# Altium project Medical_Box_Ver_2.PrjPcb
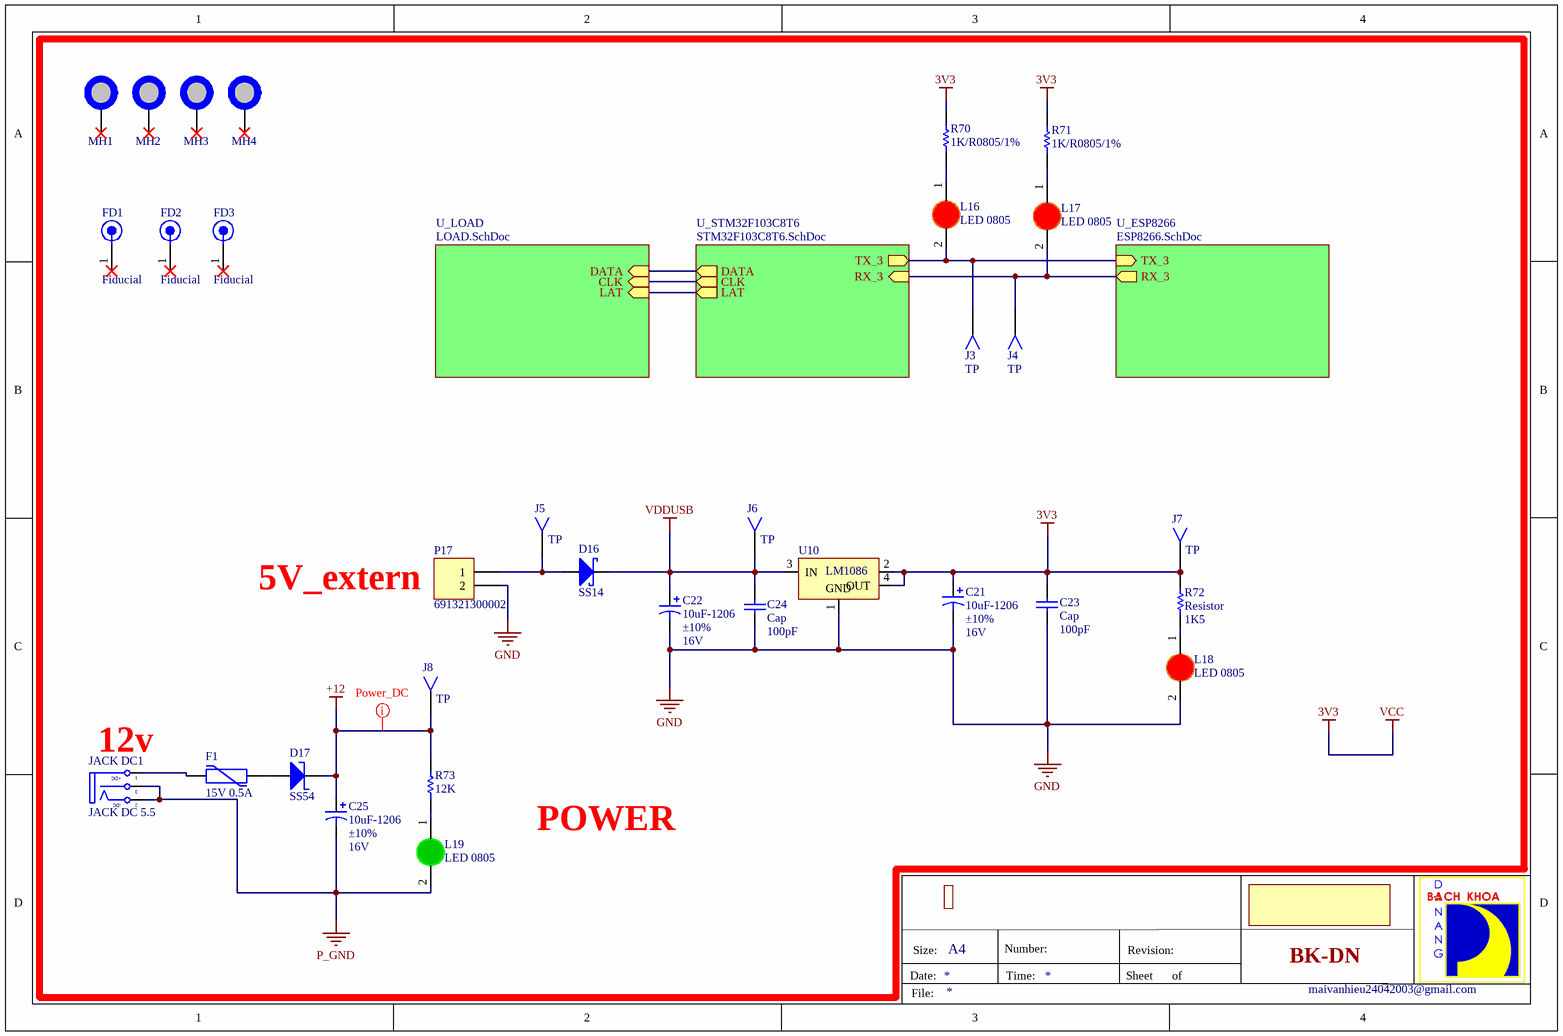
[diagram p0: Block_Diagram.SchDoc]
4 sheets, 206 parts. Net scope: hierarchical (ports join the sheet entries above them; power ports are global).
Board file: PCB1.PcbDoc
Sheets:
  Block_Diagram.SchDoc
    U_ESP8266 = ESP8266.SchDoc
    U_LOAD = LOAD.SchDoc
    U_STM32F103C8T6 = STM32F103C8T6.SchDoc

## Sheet Block_Diagram.SchDoc
size A4; Author: Van Hieu; Organization: BACH-KHOA-DK; Gmail: maivanhieu24042003@gmail.com

### Parts
C21  10uF-1206  Tolerance: ±10%  Voltage - Rated: 16V  [CAP1206_TANTALUM_YELLOW]
C22  10uF-1206  Tolerance: ±10%  Voltage - Rated: 16V  [CAP1206_TANTALUM_YELLOW]
C23  Cap  value 100pF  [CAPC2012L]
C24  Cap  value 100pF  [CAPC2012L]
C25  10uF-1206  Tolerance: ±10%  Voltage - Rated: 16V  [CAP1206_TANTALUM_YELLOW]
D16  SS14  [DIODE SMD]
D17  SS54  [DO-214AB/SMC]
F1  15V 0.5A  [FUSE_PTC_SMD1812_02]
FD1  Fiducial  [FIDUCIAL_TOP]
FD2  Fiducial  [FIDUCIAL_TOP]
FD3  Fiducial  [FIDUCIAL_TOP]
J3  TP  [TEST_POINT_1.0X1.0MM]
J4  TP  [TEST_POINT_1.0X1.0MM]
J5  TP  [TEST_POINT_1.0X1.0MM]
J6  TP  [TEST_POINT_1.0X1.0MM]
J7  TP  [TEST_POINT_1.0X1.0MM]
J8  TP  [TEST_POINT_1.0X1.0MM]
JACK_DC1  JACK DC 5.5  [JACK DC 5.5]
L16  LED 0805  [LED-RED-0805]
L17  LED 0805  [LED-RED-0805]
L18  LED 0805  [LED-RED-0805]
L19  LED 0805  [LED-GREEN-0805]
MH1  MH_3MMC_2.1MMD  [MH_3MMD_2.1MMD]  (value not drawn)  (no BOM)
MH2  MH_3MMC_2.1MMD  [MH_3MMD_2.1MMD]  (value not drawn)  (no BOM)
MH3  MH_3MMC_2.1MMD  [MH_3MMD_2.1MMD]  (value not drawn)  (no BOM)
MH4  MH_3MMC_2.1MMD  [MH_3MMD_2.1MMD]  (value not drawn)  (no BOM)
P17  691321300002  [TERMINAL_KF2EDGV_F_1X2_3.81]
R70  1K/R0805/1%  [Res 0805 SMD]
R71  1K/R0805/1%  [Res 0805 SMD]
R72  Resistor  value 1K5  [RESC2012L]
R73  value 12K  [RESC2012L]  (hidden comment: Resistor)
U10  LM1086  [LM1086]

### Sub-sheets
U_ESP8266 = ESP8266.SchDoc: RX_3 (out), TX_3 (in)
U_LOAD = LOAD.SchDoc: DATA (in), CLK (in), LAT (in)
U_STM32F103C8T6 = STM32F103C8T6.SchDoc: RX_3 (in), TX_3 (out), DATA (out), CLK (out), LAT (out)

### Nets
3V3: C21.1 C23.1 J7.1 R70.2 R71.2 R72.1 U10.2(OUT) U10.4(OUT)  [also labelled VCC]
+12: C25.1 D17.2(K) J8.1 R73.2
GND: C21.2 C22.2 C23.2 C24.2 L18.2(K) P17.2 U10.1(GND)
P_GND: C25.2 JACK_DC1.2(TN) JACK_DC1.3(S) L19.2(K)
VDDUSB: C22.1 C24.1 D16.2(K) J6.1 U10.3(IN)
CLK: sheet U_LOAD/CLK, sheet U_STM32F103C8T6/CLK
DATA: sheet U_LOAD/DATA, sheet U_STM32F103C8T6/DATA
LAT: sheet U_LOAD/LAT, sheet U_STM32F103C8T6/LAT
RX_3: J4.1 L17.2(K) ; sheet U_ESP8266/RX_3, sheet U_STM32F103C8T6/RX_3
TX_3: J3.1 L16.2(K) ; sheet U_ESP8266/TX_3, sheet U_STM32F103C8T6/TX_3
NetD16_1: D16.1(A) J5.1 P17.1
NetD17_1: D17.1(A) F1.2
NetF1_1: F1.1 JACK_DC1.1(T)
NetL16_1: L16.1(A) R70.1
NetL17_1: L17.1(A) R71.1
NetL18_1: L18.1(A) R72.2
NetL19_1: L19.1(A) R73.1

Not connected (* = marked no-connect by the designer): FD1 1*; FD2 1*; FD3 1*; MH1 1*; MH2 1*; MH3 1*; MH4 1*

### Layout directives
power_DC: power_DC: +12

### Notes on the sheet
- (near P17) 5V_extern
- (near JACK_DC1) 12v
- POWER
- Van Hieu
- Date:
- Size:
- A4
- Number:
- Time:
- Sheet
- Revision:
- of
- BK-DN
- File:
- maivanhieu24042003@gmail.com
- (in symbol JACK DC 5.5) +DC; -DC

### Library data of the parts
C21 C22 C25 = T491A106K016AT: CAP TANT 10UF 16V 10% 1206; Manufacturer 1: KEMET; Manufacturer Size Code: A; Category 1: Capacitors; Capacitance: 10µF; Type: Molded; ESR (Equivalent Series Resistance): 7 Ohm; Lifetime @ Temp.: 2000 Hrs @ 85°C; Supplier 1: Digi-Key; Supplier Part Number 1: 399-8269-1-ND; Manufacturer Part Number 1: T491A106K016AT; RoHS 1: RoHS Compliant; Description 1: CAP TANT 10UF 16V 10% 1206; Stock 1: 54083; Pricing 1: 1=0.45, 10=0.312, 100=0.1873, 500=0.14048, 1000=0.11862 (USD); Packaging: Cut Tape (CT); Part Status: Active; Operating Temperature: -55°C ~ 125°C; Mounting Type: Surface Mount; Package / Case: 1206 (3216 Metric); Size / Dimension: 0.126" L x 0.063" W (3.20mm x 1.60mm); Height - Seated (Max): 0.071" (1.80mm); Lead Spacing: -; Features: General Purpose; Failure Rate: -; ComponentLink1URL: http://www.kemet.com/Lists/ProductCatalog/Attachments/254/KEM_T2005_T491.pdf; ComponentLink1Description: http://www.kemet.com/Lists/ProductCatalog/Attachments/254/KEM_T2005_T491.pdf; Value: 10uF
C23 C24 = Cap: Capacitor; Published: 8-Jun-2000; LatestRevisionDate: 17-Jul-2002; LatestRevisionNote: Re-released for DXP Platform.; PackageReference: RAD-0.3; Publisher: Altium Limited
D16 = Diode SS14 ( 1N5819): Dán; Ma_Hang: MH002211; Don_Vi: Con; So_Chan: 2; Kieu_Chan: DO214; Ten_Linh_Kien: Diode SS14 DO214 Schottky 1A 40V ( 1N5819 DO214); Chung_Loai: Dán
D17 = Diode Schottky: Buy Link: https://www.thegioiic.com/products/ss54-smc
F1 = FUSE_MF-MSMF050-2: BOURNS         MF-MSMF110/16-2            FUSE, RESETTABLE PTC, 16V, 1.1A, 1812, FULL REEL; Number of Terminals/Pins: 2; Max Current Rating: 100A; Power Dissipation: 800mW; Hold Current: 500mA; Trip Current: 1A; Resistance: 150mR; Time to Trip: 0.15s; Aging: 1000 hr @ +85 °C (Passive); Approvals: UL,CSA,TUV; Supplier 1: Digi-Key; Supplier Part Number 1: MF-MSMF050-2TR-ND; Manufacturer: Bourns; Manufacturer Part Number: MF-MSMF050-2; RoHS: Yes; Category: Fuses; Stock 1: 20000; Pricing 1: 2000=0.15300, 4000=0.14400, 6000=0.13500, 10000=0.12600 (USD); Mount: Surface Mount,PCB; Case/Package: 1812; Number of Pins: 2; Case Code (Metric): 4532; Case Code (Imperial): 1812; Contact Plating: Gold; Terminal Material: Gold; Min Operating Temperature: -40°C; Max Operating Temperature: 85°C; Package Quantity: 2000; Packaging: Tape and Reel; Voltage Rating: 15V; Operating Supply Voltage: 15V; Current Rating: 100A; Termination: SMD/SMT; Voltage Rating (DC): 15V; Series: MF-MSMF; Length: 4.73mm; Width: 3.41mm; Height: 0.85mm; Radiation Hardening: No; REACH SVHC: No SVHC; Lead Free: Lead Free; RoHS Compliant: Yes; ComponentLink1URL: https://datasheet.ciiva.com/34302/1164200-34302041.pdf?src-supplier=Jameco; ComponentLink1Description: https://datasheet.ciiva.com/34302/1164200-34302041.pdf?src-supplier=Jameco; ComponentLink2URL: https://datasheet.ciiva.com/326/mfmsmf-326354.pdf?src-supplier=Digi-Key; ComponentLink2Description: https://datasheet.ciiva.com/326/mfmsmf-326354.pdf?src-supplier=Digi-Key; ComponentLink3URL: https://datasheet.ciiva.com/1228/1786007-1228155.pdf?src-supplier=Newark; ComponentLink3Description: https://datasheet.ciiva.com/1228/1786007-1228155.pdf?src-supplier=Newark; ComponentLink4URL: https://datasheet.ciiva.com/16205/mfmsmf-16205994.pdf?src-supplier=Onlinecomponents.com; ComponentLink4Description: https://datasheet.ciiva.com/16205/mfmsmf-16205994.pdf?src-supplier=Onlinecomponents.com; ComponentLink5URL: https://datasheet.ciiva.com/14537/70153434-14537737.pdf?src-supplier=Allied+Electronics; ComponentLink5Description: https://datasheet.ciiva.com/14537/70153434-14537737.pdf?src-supplier=Allied+Electronics; ComponentLink6URL: https://datasheet.ciiva.com/46395/1695373-46395287.pdf?src-supplier=Element14; ComponentLink6Description: https://datasheet.ciiva.com/46395/1695373-46395287.pdf?src-supplier=Element14; ComponentLink7URL: https://datasheet.ciiva.com/22749/1695373-22749079.pdf?src-supplier=Element14; ComponentLink7Description: https://datasheet.ciiva.com/22749/1695373-22749079.pdf?src-supplier=Element14; ComponentLink8URL: https://datasheet.ciiva.com/32426/mf-msmf-series-eng-tds-32426126.pdf?src-supplier=Distrelec; ComponentLink8Description: https://datasheet.ciiva.com/32426/mf-msmf-series-eng-tds-32426126.pdf?src-supplier=Distrelec; ComponentLink9URL: https://datasheet.ciiva.com/4501/mfmsmf-72300-4501655.pdf?src-supplier=Mouser; ComponentLink9Description: https://datasheet.ciiva.com/4501/mfmsmf-72300-4501655.pdf?src-supplier=Mouser; ComponentLink10URL: https://datasheet.ciiva.com/3019/mfmsmf-3019622.pdf?src-supplier=Avnet; ComponentLink10Description: https://datasheet.ciiva.com/3019/mfmsmf-3019622.pdf?src-supplier=Avnet; ComponentLink11URL: https://datasheet.ciiva.com/3019/mfmsmf-3019621.pdf?src-supplier=Avnet; ComponentLink11Description: https://datasheet.ciiva.com/3019/mfmsmf-3019621.pdf?src-supplier=Avnet; ComponentLink12URL: https://datasheet.ciiva.com/326/mfmsmf-326356.pdf?src-supplier=Digi-Key; ComponentLink12Description: https://datasheet.ciiva.com/326/mfmsmf-326356.pdf?src-supplier=Digi-Key; ComponentLink13URL: https://datasheet.ciiva.com/1274/1786007-1274499.pdf?src-supplier=Element14; ComponentLink13Description: https://datasheet.ciiva.com/1274/1786007-1274499.pdf?src-supplier=Element14; ComponentLink14URL: https://datasheet.ciiva.com/326/mfmsmf-326355.pdf?src-supplier=Digi-Key; ComponentLink14Description: https://datasheet.ciiva.com/326/mfmsmf-326355.pdf?src-supplier=Digi-Key; ComponentLink15URL: https://datasheet.ciiva.com/1274/1786007-1274498.pdf?src-supplier=Element14; ComponentLink15Description: https://datasheet.ciiva.com/1274/1786007-1274498.pdf?src-supplier=Element14; ComponentLink16URL: https://datasheet.ciiva.com/15226/getdatasheetpartid-117168-15226886.pdf?src-supplier=Verical; ComponentLink16Description: https://datasheet.ciiva.com/15226/getdatasheetpartid-117168-15226886.pdf?src-supplier=Verical; ComponentLink17URL: https://datasheet.ciiva.com/25894/mfmsmf-25894175.pdf?src-supplier=Avnet+Europe; ComponentLink17Description: https://datasheet.ciiva.com/25894/mfmsmf-25894175.pdf?src-supplier=Avnet+Europe; Supplier 2: Digi-Key; Supplier Part Number 2: MF-MSMF110/16-2TR-ND; Stock 2: 8000; Pricing 2: 2000=0.16800, 4000=0.16500, 6000=0.16200, 10000=0.15960 (USD); Max Power Dissipation: 800mW; ComponentLink18URL: https://datasheet.ciiva.com/16206/mfmsmf-16206000.pdf?src-supplier=Onlinecomponents.com; ComponentLink18Description: https://datasheet.ciiva.com/16206/mfmsmf-16206000.pdf?src-supplier=Onlinecomponents.com; ComponentLink19URL: https://datasheet.ciiva.com/34302/1164242-34302042.pdf?src-supplier=Jameco; ComponentLink19Description: https://datasheet.ciiva.com/34302/1164242-34302042.pdf?src-supplier=Jameco; ComponentLink20URL: https://datasheet.ciiva.com/326/mfmsmf-326551.pdf?src-supplier=Digi-Key; ComponentLink20Description: https://datasheet.ciiva.com/326/mfmsmf-326551.pdf?src-supplier=Digi-Key; ComponentLink21URL: https://datasheet.ciiva.com/1274/1786007-1274504.pdf?src-supplier=Element14; ComponentLink21Description: https://datasheet.ciiva.com/1274/1786007-1274504.pdf?src-supplier=Element14; ComponentLink22URL: https://datasheet.ciiva.com/326/mfmsmf-326553.pdf?src-supplier=Digi-Key; ComponentLink22Description: https://datasheet.ciiva.com/326/mfmsmf-326553.pdf?src-supplier=Digi-Key; ComponentLink23URL: https://datasheet.ciiva.com/1274/1786007-1274505.pdf?src-supplier=Element14; ComponentLink23Description: https://datasheet.ciiva.com/1274/1786007-1274505.pdf?src-supplier=Element14; ComponentLink24URL: https://datasheet.ciiva.com/17401/mfmsmf-17401721.pdf?src-supplier=Avnet+Europe; ComponentLink24Description: https://datasheet.ciiva.com/17401/mfmsmf-17401721.pdf?src-supplier=Avnet+Europe; ComponentLink25URL: https://datasheet.ciiva.com/30134/575mfmsmf-30134057.pdf?src-supplier=Onlinecomponents.com; ComponentLink25Description: https://datasheet.ciiva.com/30134/575mfmsmf-30134057.pdf?src-supplier=Onlinecomponents.com; ComponentLink26URL: https://datasheet.ciiva.com/3020/mfmsmf-3020011.pdf?src-supplier=Avnet; ComponentLink26Description: https://datasheet.ciiva.com/3020/mfmsmf-3020011.pdf?src-supplier=Avnet; ComponentLink27URL: https://datasheet.ciiva.com/3019/mfmsmf-3019628.pdf?src-supplier=Avnet; ComponentLink27Description: https://datasheet.ciiva.com/3019/mfmsmf-3019628.pdf?src-supplier=Avnet; ComponentLink28URL: https://datasheet.ciiva.com/1228/1786007-1228158.pdf?src-supplier=Newark; ComponentLink28Description: https://datasheet.ciiva.com/1228/1786007-1228158.pdf?src-supplier=Newark; ComponentLink29URL: https://datasheet.ciiva.com/28411/1695373-28411566.pdf?src-supplier=Element14; ComponentLink29Description: https://datasheet.ciiva.com/28411/1695373-28411566.pdf?src-supplier=Element14; ComponentLink30URL: https://datasheet.ciiva.com/326/mfmsmf-326552.pdf?src-supplier=Digi-Key; ComponentLink30Description: https://datasheet.ciiva.com/326/mfmsmf-326552.pdf?src-supplier=Digi-Key; ComponentLink31URL: https://datasheet.ciiva.com/14538/70153434-14538680.pdf?src-supplier=Allied+Electronics; ComponentLink31Description: https://datasheet.ciiva.com/14538/70153434-14538680.pdf?src-supplier=Allied+Electronics; ComponentLink32URL: https://datasheet.ciiva.com/15187/getdatasheetpartid-115224-15187116.pdf?src-supplier=Verical; ComponentLink32Description: https://datasheet.ciiva.com/15187/getdatasheetpartid-115224-15187116.pdf?src-supplier=Verical
J3-J8 = TEST POINT 1.0X1.0: Manufacturer 1: Bourns Inc.; Manufacturer Part Number 1: PTV09A-4020U-B103; Description 1: POT 10K OHM 1/20W CARBON LINEAR; Category 1: Potentiometers, Variable Resistors; Resistance (Ohms): 10k; Tolerance: ±20%; Built in Switch: None; Power (Watts): 0.05W, 1/20W; Number of Turns: 1; Rotation: 280°; Adjustment Type: Top Adjustment; Resistive Material: Carbon; Actuator Type: Knurled; Actuator Length: 0.787" (20.00mm); Actuator Diameter: 0.236" (6.00mm); Supplier 1: Digi-Key; Supplier Part Number 1: PTV09A-4020U-B103-ND; RoHS 1: RoHS Compliant; Stock 1: 414; Pricing 1: 1=0.83, 10=0.744, 25=0.672, 50=0.648, 100=0.612, 250=0.588, 500=0.552, 1000=0.456, 5000=0.372 (USD); Packaging: Tray; Part Status: Active; Taper: Linear; Temperature Coefficient: -; Termination Style: PC Pins, Board Locks; Bushing Thread: -; Mounting Type: Through Hole, Snap In; ComponentLink1URL: http://www.bourns.com/docs/Product-Datasheets/PTV09.pdf; ComponentLink1Description: http://www.bourns.com/docs/Product-Datasheets/PTV09.pdf
JACK_DC1 = JACK DC 5.5: Value: Jac DC
L16-L18 = LED RED 0805: SMD; Don_Vi: Con; Chung_Loai: Dán; Ma_Hang: MH000897; Ten_Linh_Kien: LED 0805 Màu Đỏ (Red); Ghi_Chu: *; Kieu_Chan: *
L19 = LED GREEN 0805: SMD; Don_Vi: Con; Chung_Loai: Dán; Ma_Hang: MH000897; Ten_Linh_Kien: LED 0805 Màu Đỏ (Red); Ghi_Chu: *; Kieu_Chan: *
MH1-MH4 = MH_3MMC_2.1MMD: Mounting Hole 3mm Diameter, 2.1mm Drill
P17 = TERMINAL_KF2EDGV_F_1X2_3.81: TERM BLOCK HDR 2POS VERT 3.81MM; Manufacturer: Wurth Electronics Inc.; Number of Positions: 2; Number of Levels: 1; Pitch: 0.150" (3.81mm); Header Orientation: Vertical; Material Flammability Rating: UL94 V-0; Contact Tail Length: 0.138" (3.50mm); Supplier 1: Digi-Key; Manufacturer Part Number: 691321300002; RoHS: RoHS Compliant; Category: Connectors, Interconnects; Stock 1: 2512; Pricing 1: 1=0.33, 10=0.296, 50=0.255, 100=0.2375 (USD); Packaging: Bulk; Part Status: Active; Type: Header, Male Pins, Shrouded (4 Side); Positions Per Level: 2; Plug Wire Entry: -; Termination Style: Solder; Mounting Type: Through Hole; Current - IEC: -; Wire Gauge or Range - AWG: -; Wire Gauge or Range - mm²: -; Color: Green; Operating Temperature: -40°C ~ 105°C; Contact Mating Finish: Tin; Features: -; Ingress Protection: -; Screw Size: -; Torque - Screw: -; Wire Strip Length: -; Contact Material: Brass; Housing Material: Polyamide (PA66), Nylon 6/6; Insulation Height: 0.362" (9.20mm); ComponentLink1URL: http://katalog.we-online.de/em/datasheet/6913213000xx.pdf; ComponentLink1Description: http://katalog.we-online.de/em/datasheet/6913213000xx.pdf; Supplier Part Number 1: 732-2082-ND
R70 R71 = 34.8K/R0805/1%_3: 1 kOhms ±1% 0.125W, 1/8W Chip Resistor 0805 (2012 Metric) Automotive AEC-Q200 Thick Film; Power Rating: 100mW; Resistance: 34.8kR; Voltage Rating: 50V; Case/Package: 0603; Case Code (Imperial): 0603; Case Code (Metric): 1608; Min Operating Temperature: -55°C; Max Operating Temperature: 155°C; Termination: SMD/SMT; Military Standard: Not; Voltage Rating (DC): 50V; Length: 1.6mm; Height: 0.45mm; Width: 0.8mm; Depth: 0.8mm; Lead Free: Lead Free; Digikey: 541-1.00KCCT-ND
R72 R73 = Resistor: Semiconductor Resistor; Published: 8-Jun-2000; LatestRevisionDate: 17-Jul-2002; LatestRevisionNote: Re-released for DXP Platform.; PackageReference: AXIAL-0.5; Publisher: Altium Limited
U10 = LM1086: Linear Voltage Regulator 3V3 1.5A 24V Max TO-220; ComponentLink1Description: Datasheet; ComponentLink1URL: D:\Dropbox\Datasheets\Power Management ICs\Linear Regulators\LM78XX.pdf; Unit Price: 0.3000

## Sheet ESP8266.SchDoc
size A3; Author: Bao Thuan; Organization: BACH-KHOA-DK
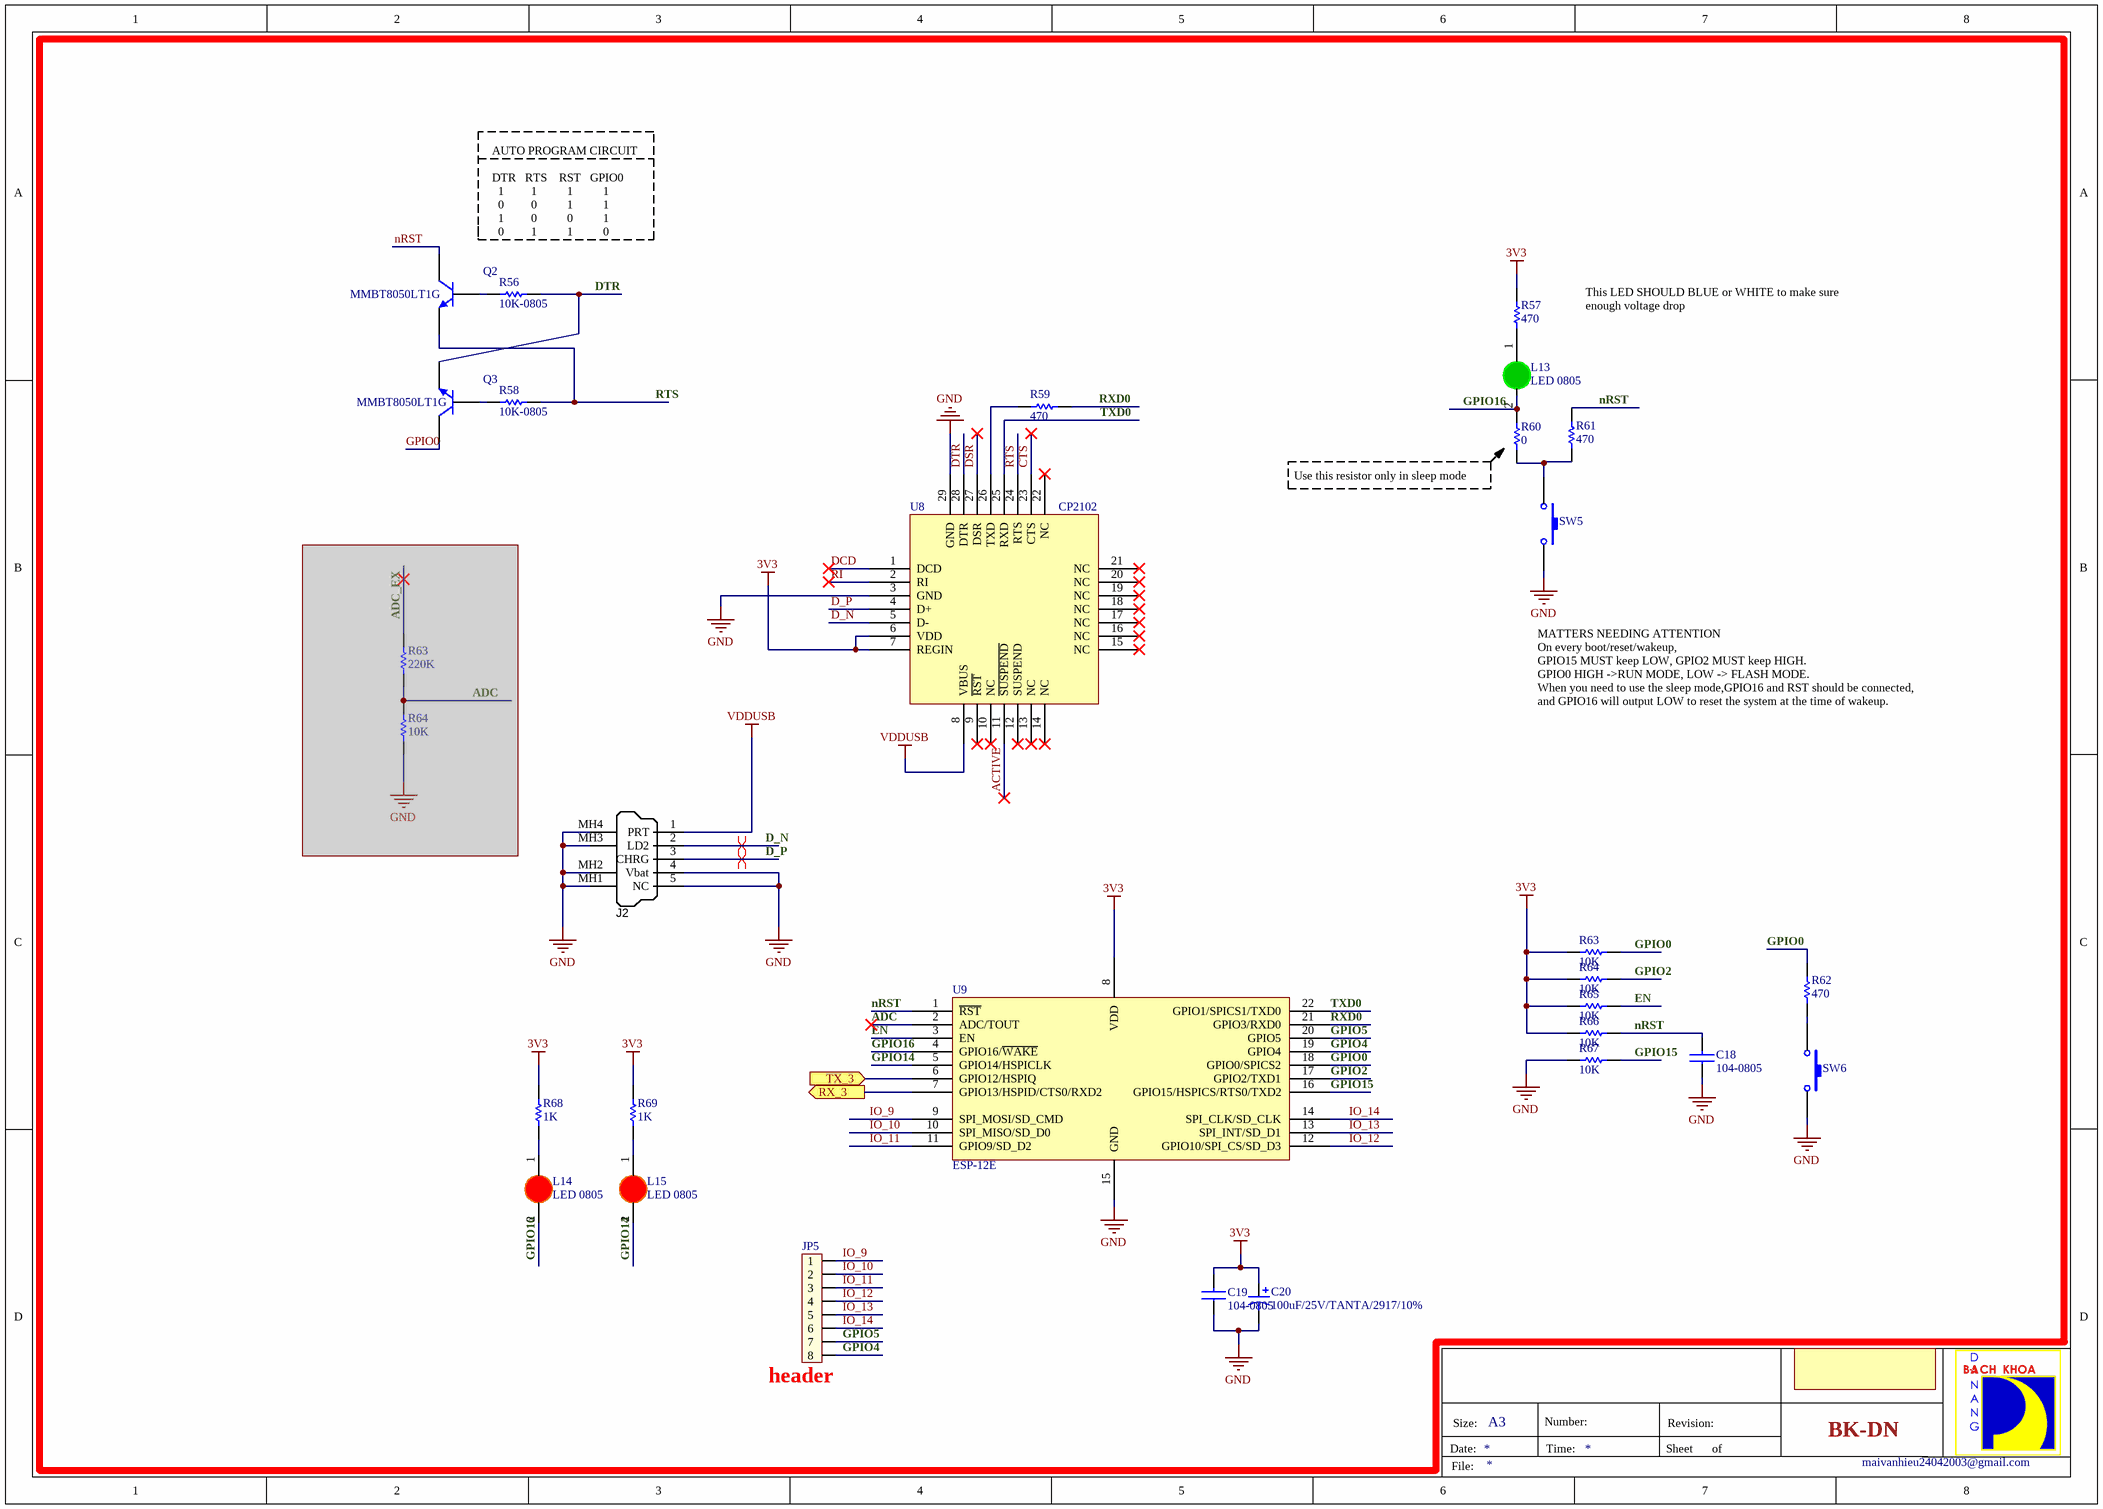
[diagram p1: ESP8266.SchDoc]

### Parts
(Parts that share a designator on the sheet are numbered #1, #2 ... from top to bottom, then left to right.)
C18  104-0805  [CAP0805]
C19  104-0805  [CAP0805]
C20  100uF/25V/TANTA/2917/10%  [CAP TANT CASE X SMD]
J2  USB_Mini-B  [USB_Mini-B_Molex_SMT]  (value not drawn)
JP5  header  [JP8]
L13  LED 0805  [LED-GREEN-0805]
L14  LED 0805  [LED-RED-0805]
L15  LED 0805  [LED-RED-0805]
Q2  MMBT8050LT1G  [SOT23]
Q3  MMBT8050LT1G  [SOT23]
R56  value 10K-0805  [RESC2012L]  (hidden comment: Resistor)
R57  value 470  [RESC2012L]  (hidden comment: Resistor)
R58  value 10K-0805  [RESC2012L]  (hidden comment: Resistor)
R59  value 470  [RESC2012L]  (hidden comment: Resistor)
R60  value 0  [RESC2012L]  (hidden comment: Resistor)
R61  value 470  [RESC2012L]  (hidden comment: Resistor)
R62  value 470  [RESC2012L]  (hidden comment: Resistor)
R63#1  value 220K  [RESC2012L]  (hidden comment: Resistor)  (masked out: inside a compile mask, not in the netlist)
R63#2  value 10K  [RESC2012L]  (hidden comment: Resistor)
R64#1  value 10K  [RESC2012L]  (hidden comment: Resistor)  (masked out: inside a compile mask, not in the netlist)
R64#2  value 10K  [RESC2012L]  (hidden comment: Resistor)
R65  value 10K  [RESC2012L]  (hidden comment: Resistor)
R66  value 10K  [RESC2012L]  (hidden comment: Resistor)
R67  value 10K  [RESC2012L]  (hidden comment: Resistor)
R68  value 1K  [RESC2012L]  (hidden comment: Resistor)
R69  value 1K  [RESC2012L]  (hidden comment: Resistor)
SW5  RS-282G05A3-SM RT  [SW_RS-282G05A3-SM RT]  (value not drawn)
SW6  RS-282G05A3-SM RT  [SW_RS-282G05A3-SM RT]  (value not drawn)
U8  CP2102  [CP2102]
U9  ESP-12E  [ESP-12E]

### Ports
RX_3 (out), TX_3 (in)

### Nets
3V3: C19.2 C20.1 R57.2 R63#2.1 R64#2.1 R65.1 R66.1 R68.2 R69.2 U8.6(VDD) U8.7(REGIN) U9.8(VDD)
GND: C18.1 C19.1 C20.2 J2.4(Vbat) J2.5(NC) J2.MH1(Shell) J2.MH2(Shell) J2.MH3(Shell) J2.MH4(Shell) R67.1 SW5.1 SW6.1 U8.3(GND) U8.29(GND) U9.15(GND)
VDDUSB: J2.1(PRT) U8.8(VBUS)
ACTIVE: U8.11(~{SUSPEND})
ADC: U9.2(ADC/TOUT)
CTS: U8.23(CTS)
D_N: J2.2(LD2) U8.5(D-)
D_P: J2.3(CHRG) U8.4(D+)
DCD: U8.1(DCD)
DSR: U8.27(DSR)
DTR: Q3.2(E) R56.2 U8.28(DTR)
EN: R65.2 U9.3(EN)
GPIO0: Q3.3(C) R62.2 R63#2.2 U9.18(GPIO0/SPICS2)
GPIO2: R64#2.2 U9.17(GPIO2/TXD1)
GPIO4: JP5.8 U9.19(GPIO4)
GPIO5: JP5.7 U9.20(GPIO5)
GPIO14: L15.2(K) U9.5(GPIO14/HSPICLK)
GPIO15: R67.2 U9.16(GPIO15/HSPICS/RTS0/TXD2)
GPIO16: L13.2(K) L14.2(K) R60.2 U9.4(GPIO16/~{WAKE})
IO_9: JP5.1 U9.9(SPI_MOSI/SD_CMD)
IO_10: JP5.2 U9.10(SPI_MISO/SD_D0)
IO_11: JP5.3 U9.11(GPIO9/SD_D2)
IO_12: JP5.4 U9.12(GPIO10/SPI_CS/SD_D3)
IO_13: JP5.5 U9.13(SPI_INT/SD_D1)
IO_14: JP5.6 U9.14(SPI_CLK/SD_CLK)
nRST: C18.2 Q2.3(C) R61.2 R66.2 U9.1(~{RST})
RI: U8.2(RI)
RTS: Q2.2(E) R58.2 U8.24(RTS)
RX_3: U9.7(GPIO13/HSPID/CTS0/RXD2) ; port RX_3
RXD0: R59.2 U9.21(GPIO3/RXD0)
TX_3: U9.6(GPIO12/HSPIQ) ; port TX_3
TXD0: U8.25(RXD) U9.22(GPIO1/SPICS1/TXD0)
NetL13_1: L13.1(A) R57.1
NetL14_1: L14.1(A) R68.1
NetL15_1: L15.1(A) R69.1
NetQ2_1: Q2.1(B) R56.1
NetQ3_1: Q3.1(B) R58.1
NetR59_1: R59.1 U8.26(TXD)
NetR60_1: R60.1 R61.1 SW5.2
NetR62_1: R62.1 SW6.2

Not connected (* = marked no-connect by the designer): U8 9(~{RST})* 10(NC)* 12(SUSPEND)* 13(NC)* 14(NC)* 15(NC)* 16(NC)* 17(NC)* 18(NC)* 19(NC)* 20(NC)* 21(NC)* 22(NC)*

### Layout directives
differential pair: D_N, D_P

### Notes on the sheet
- AUTO PROGRAM CIRCUIT
  DTR   RTS    RST   GPIO0
  1         1          1          1
  0         0          1          1
  1         0          0          1
  0         1          1          0
- This LED SHOULD BLUE or WHITE to make sure enough voltage drop
- Use this resistor only in sleep mode
- MATTERS NEEDING ATTENTION
  On every boot/reset/wakeup,
  GPIO15 MUST keep LOW, GPIO2 MUST keep HIGH.
  GPIO0 HIGH ->RUN MODE, LOW -> FLASH MODE.
  When you need to use the sleep mode,GPIO16 and RST should be connected,
  and GPIO16 will output LOW to reset the system at the time of wakeup.
- Van Hieu
- Date:
- Size:
- A3
- Number:
- Time:
- Sheet
- Revision:
- of
- BK-DN
- File:
- maivanhieu24042003@gmail.com

### Library data of the parts
C18 C19 = CC0805JRNPO9BN200: Multilayer Ceramic Capacitors MLCC - SMD/SMT 20pF 50V NPO 5%; Manufacturer: Yageo; Type: General Purpose Surface-Mount Ceramic Multilayer Capacitor; Voltage Rating DC: 50 VDC; Class: Class 1; Dielectric: C0G (NP0); Supplier 1: Mouser; Manufacturer Part Number: CC0805JRNPO9BN200; RoHS: RoHS Compliant By Exemption; Category: Multilayer Ceramic Capacitors MLCC - SMD/SMT; Stock 1: 0; Pricing 1: 1=0.100, 10=0.040, 100=0.018, 1000=0.014, 4000=0.013 (USD); Capacitance: 20 pF; Length: 2 mm; Package / Case: 0805 (2012 metric); Packaging: Cut Tape; Product: General Type MLCCs; Series: CC; Termination Style: SMD/SMT; Tolerance: 5 %; Width: 1.25 mm; Brand: Yageo; Case Code - in: 0805; Case Code - mm: 2012; Maximum Operating Temperature: + 125 C; Minimum Operating Temperature: - 55 C; Product Type: Ceramic Capacitors; Standard Pack Qty: 4000; Subcategory: Capacitors; Termination: Standard; RoHS - Mouser: E; Minimum Order Quantity: 1; Reeling: True; ComponentLink1URL: http://www.mouser.com/datasheet/2/447/UPY-GP_NP0_16V-to-50V_16-1109089.pdf; ComponentLink1Description: http://www.mouser.com/datasheet/2/447/UPY-GP_NP0_16V-to-50V_16-1109089.pdf; Supplier Part Number 1: 603-CC805JRNPO9BN200
C20 = 100uF/6.3V/SIZE B/20%: CAP TANT 100UF 6.3V 20% 1411; Manufacturer: Kemet; Manufacturer Part Number: T491B107M006AT; Manufacturer Size Code: B; Capacitance: 100µF; ESR (Equivalent Series Resistance): 3 Ohm; Type: Molded; Lifetime @ Temp.: 2000 Hrs @ 85°C; RoHS: RoHS Compliant; Category: Capacitors; Packaging: Cut Tape (CT); Tolerance: ±20%; Voltage - Rated: 6.3V; Operating Temperature: -55°C ~ 125°C; Mounting Type: Surface Mount; Package / Case: 1411 (3528 Metric); Size / Dimension: 0.138" L x 0.110" W (3.50mm x 2.80mm); Height - Seated (Max): 0.083" (2.10mm); Lead Spacing: -; Features: General Purpose; ComponentLink1URL: http://www.kemet.com/Lists/ProductCatalog/Attachments/254/KEM_T2005_T491.pdf; ComponentLink1Description: http://www.kemet.com/Lists/ProductCatalog/Attachments/254/KEM_T2005_T491.pdf; Supplier 1: Digi-Key; Supplier Part Number 1: 399-3710-1-ND
J2 = USB_Mini-B: Connector SMD USB Type Mini-B; Manufacturer 1: Molex Connector Corporation; Manufacturer Part Number 1: 67503-1020; SCDType: undef; Package / Case: SMD; Supplier 1: Digi-Key; Supplier Part Number 1: WM5461CT-ND
JP5 = JP8: JP8 PIN; Value: JP7
L13 = LED GREEN 0805: as L19 on sheet Block_Diagram; Ghi_Chu: *; Kieu_Chan: *
L14 L15 = LED RED 0805: as L16 on sheet Block_Diagram; Ghi_Chu: *; Kieu_Chan: *
Q2 Q3 = MMBT8050LT1G_SMD: NPN General Purpose Amplifier; Published: 8-Jun-2000; LatestRevisionDate: 15-Jan-2003; LatestRevisionNote: PCB Footprint 'BCY-W3/D4.7' replaced; DatasheetVersion: 1997; PackageVersion: Sep-1998; PackageReference: TO-92A; Publisher: Altium Limited; Code_JEDEC: TO-92A; ComponentLink1Description: Manufacturer Link; ComponentLink1URL: http://www.fairchildsemi.com/; ComponentLink2Description: Datasheet; ComponentLink2URL: http://www.fairchildsemi.com/ds/2N%2F2N3904.pdf
R56-R62 R63#1 R63#2 R64#1 R64#2 R65-R69 = Resistor: Semiconductor Resistor; Published: 8-Jun-2000; LatestRevisionDate: 17-Jul-2002; LatestRevisionNote: Re-released for DXP Platform.; PackageReference: AXIAL-0.5; Publisher: Altium Limited
SW5 SW6 = SW_RS-282G05A3-SM RT: SWITCH TACTILE SPST-NO 0.05A 12V; Manufacturer: C&K; Switch Function: Off-Mom; Contact Rating @ Voltage: 0.05A @ 12VDC; Actuator Type: Rectangular Button; Actuator Height off PCB, Vertical: 2.50mm; Actuator Orientation: Top Actuated; Outline: 6.00mm x 3.60mm; Illumination: Non-Illuminated; Operating Force: 250gf; Actuator Material: Polyamide (PA), Nylon; Switch Travel: 0.25mm; Mechanical Life: 50,000 Cycles; Supplier 1: Digi-Key; Manufacturer Part Number: RS-282G05A3-SM RT; RoHS: RoHS Compliant; Category: Switches; Stock 1: 34459; Pricing 1: 1=0.81, 10=0.78, 25=0.7356, 50=0.6474, 100=0.5885, 250=0.55908, 500=0.54436, 1000=0.42666 (USD); Packaging: Digi-Reel®; Part Status: Active; Circuit: SPST-NO; Mounting Type: Surface Mount; Actuator Length, Right Angle: -; Termination Style: Gull Wing; Illumination Type, Color: -; Illumination Voltage (Nominal): -; Ingress Protection: -; Features: -; Operating Temperature: -; ComponentLink1URL: http://media.digikey.com/pdf/Data%20Sheets/C&K/RS-282G05A-SM_RT.pdf; ComponentLink1Description: http://media.digikey.com/pdf/Data%20Sheets/C&K/RS-282G05A-SM_RT.pdf; Supplier Part Number 1: CKN10384DKR-ND
U9 = ESP_12_E: ESP8266 ESP-12E Module (ESP8266, Castellated Holes); IC: ESP8266-EX; Vendor: Ai-thinker

## Sheet LOAD.SchDoc
size A2; Author: Van Hieu; Organization: BACH-KHOA-DK; Gmail: maivanhieu24042003@gmail.com
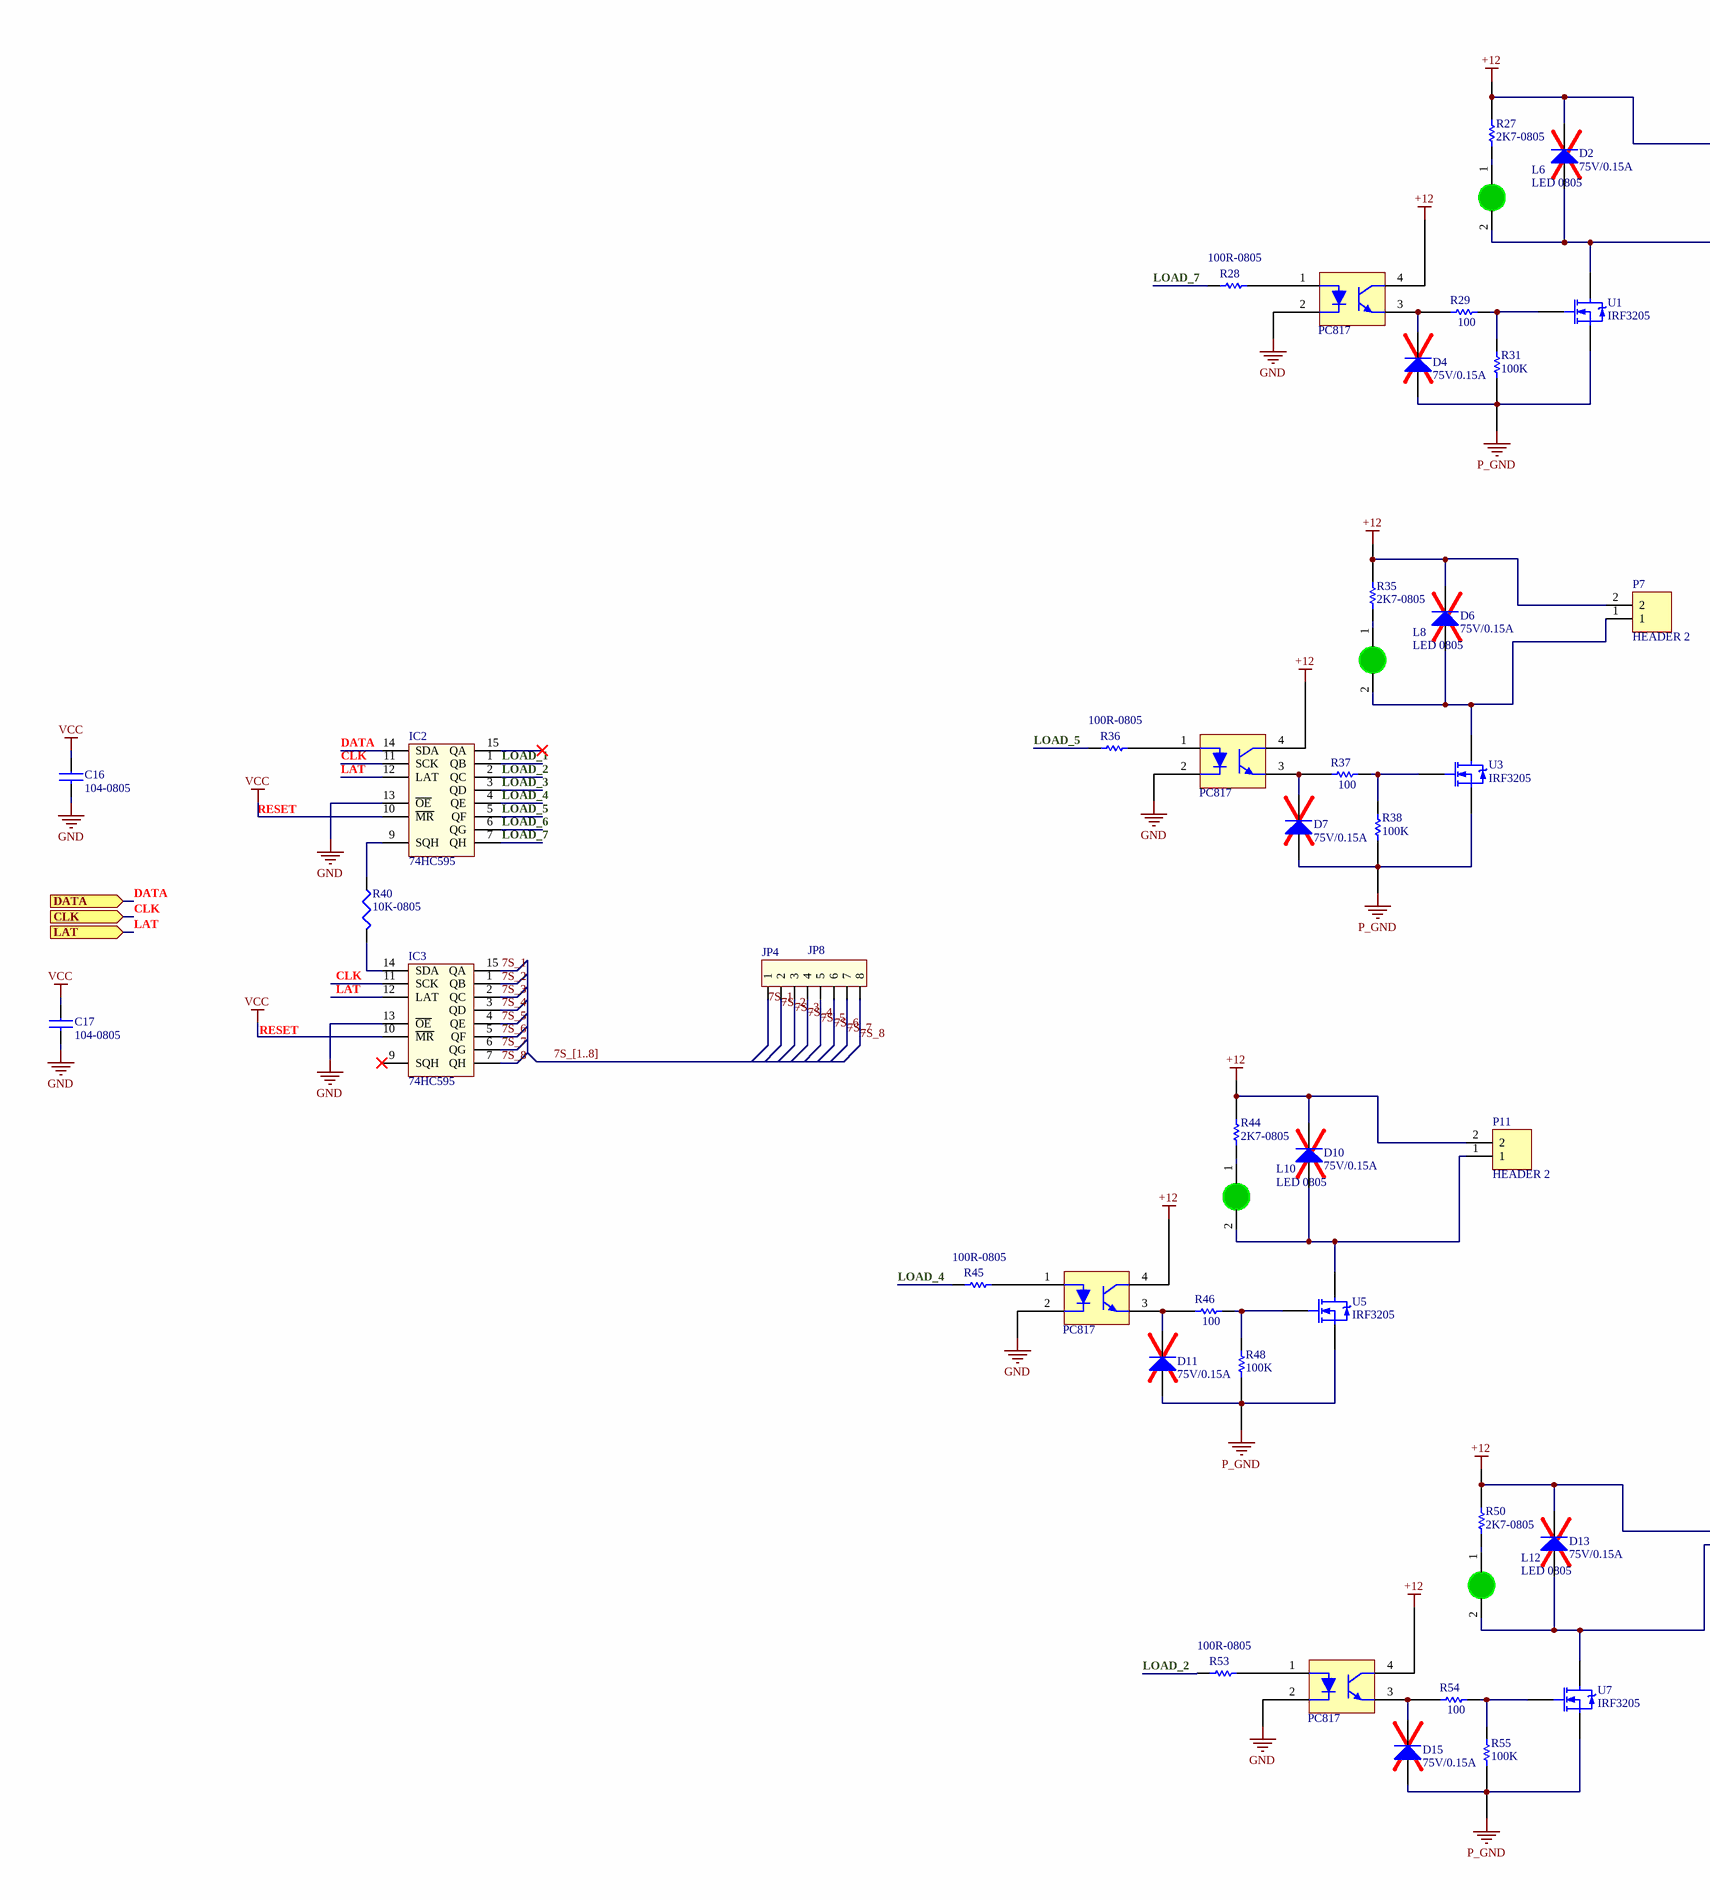
[diagram p2: LOAD.SchDoc, left]
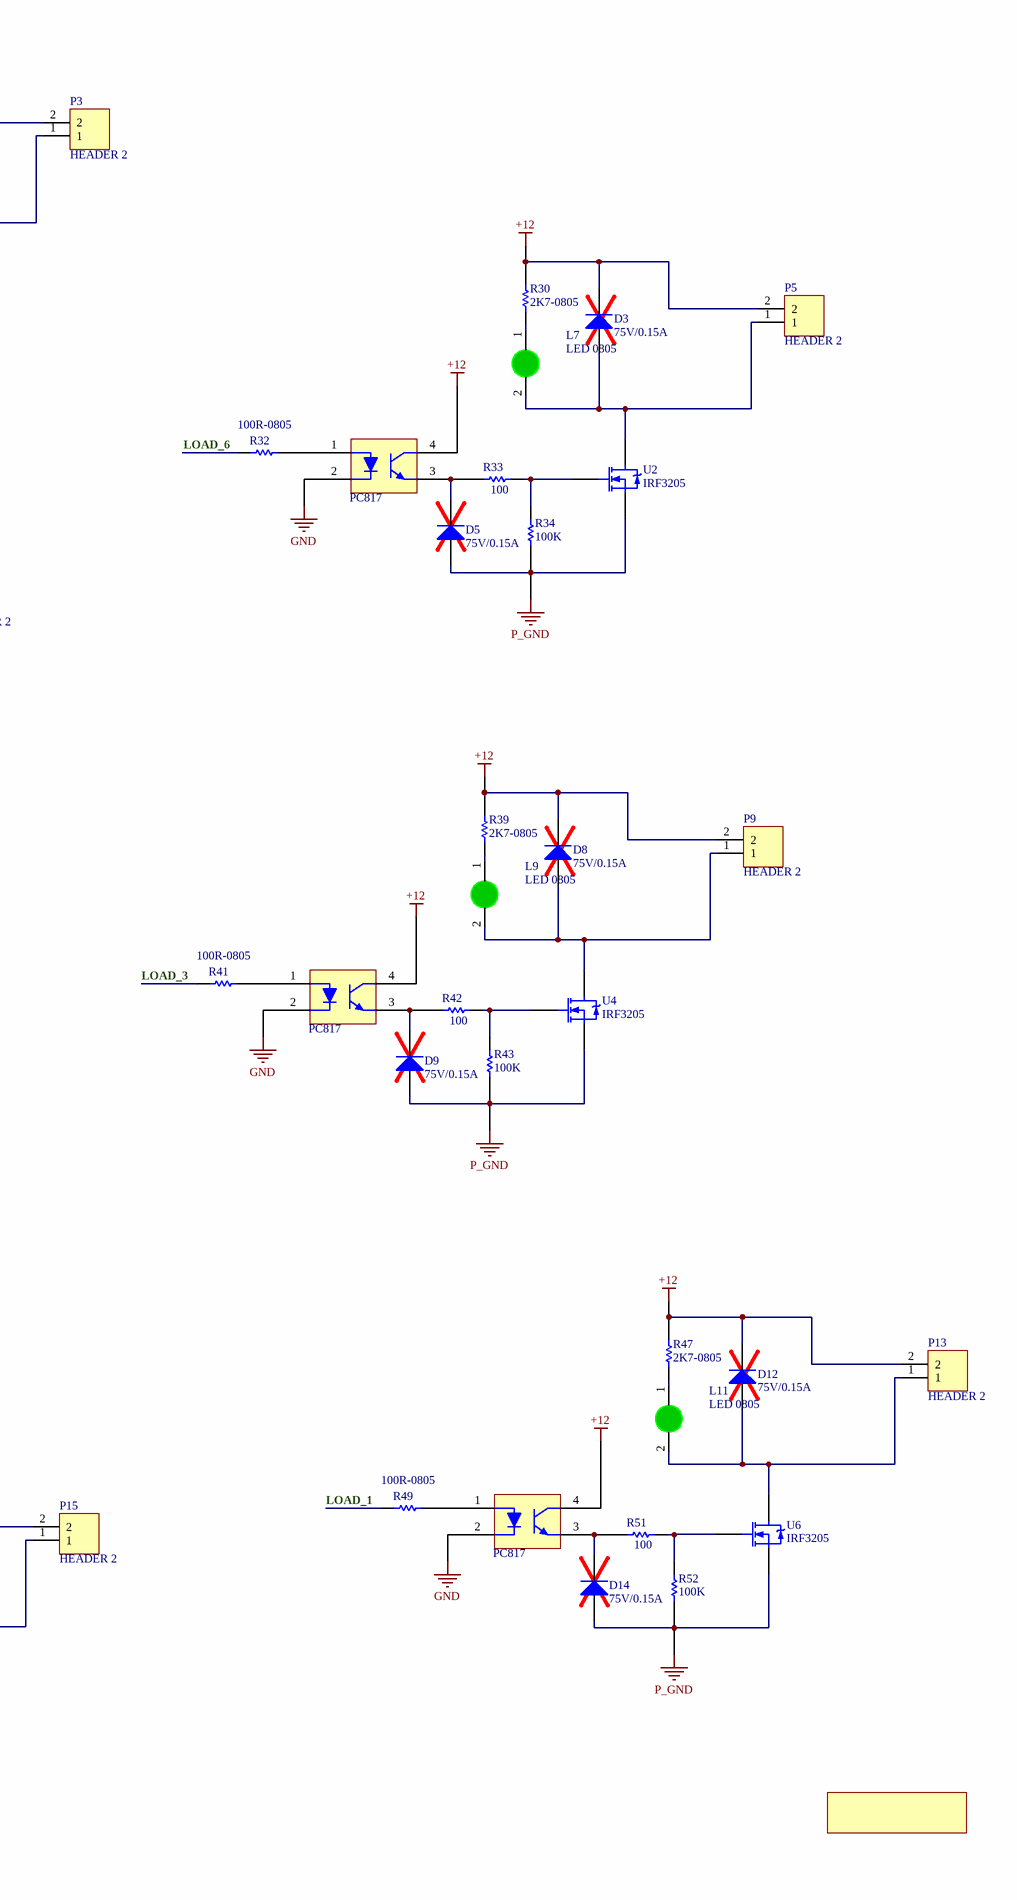
[diagram p3: LOAD.SchDoc, right]

### Parts
C16  104-0805  [CAP0805]
C17  104-0805  [CAP0805]
D2  75V/0.15A  [DIO-SOD232-1.15H]
D3  75V/0.15A  [DIO-SOD232-1.15H]
D4  75V/0.15A  [DIO-SOD232-1.15H]
D5  75V/0.15A  [DIO-SOD232-1.15H]
D6  75V/0.15A  [DIO-SOD232-1.15H]
D7  75V/0.15A  [DIO-SOD232-1.15H]
D8  75V/0.15A  [DIO-SOD232-1.15H]
D9  75V/0.15A  [DIO-SOD232-1.15H]
D10  75V/0.15A  [DIO-SOD232-1.15H]
D11  75V/0.15A  [DIO-SOD232-1.15H]
D12  75V/0.15A  [DIO-SOD232-1.15H]
D13  75V/0.15A  [DIO-SOD232-1.15H]
D14  75V/0.15A  [DIO-SOD232-1.15H]
D15  75V/0.15A  [DIO-SOD232-1.15H]
IC2  74HC595  [HC595_SOP127P600X175-16N]
IC3  74HC595  [HC595_SOP127P600X175-16N]
JP4  JP8  [CON8]
L6  LED 0805  [LED-GREEN-0805]
L7  LED 0805  [LED-GREEN-0805]
L8  LED 0805  [LED-GREEN-0805]
L9  LED 0805  [LED-GREEN-0805]
L10  LED 0805  [LED-GREEN-0805]
L11  LED 0805  [LED-GREEN-0805]
L12  LED 0805  [LED-GREEN-0805]
P3  HEADER 2  [HT508R-2P]
P4  PC817  [DIP-4]
P5  HEADER 2  [HT508R-2P]
P6  PC817  [DIP-4]
P7  HEADER 2  [HT508R-2P]
P8  PC817  [DIP-4]
P9  HEADER 2  [HT508R-2P]
P10  PC817  [DIP-4]
P11  HEADER 2  [HT508R-2P]
P12  PC817  [DIP-4]
P13  HEADER 2  [HT508R-2P]
P14  PC817  [DIP-4]
P15  HEADER 2  [HT508R-2P]
P16  PC817  [DIP-4]
R27  2K7-0805  [RESC2012L]
R28  100R-0805  [RESC2012L]
R29  100  [Res 0805 SMD]
R30  2K7-0805  [RESC2012L]
R31  100K  [Res 0805 SMD]
R32  100R-0805  [RESC2012L]
R33  100  [Res 0805 SMD]
R34  100K  [Res 0805 SMD]
R35  2K7-0805  [RESC2012L]
R36  100R-0805  [RESC2012L]
R37  100  [Res 0805 SMD]
R38  100K  [Res 0805 SMD]
R39  2K7-0805  [RESC2012L]
R40  10K-0805  [RES0805]
R41  100R-0805  [RESC2012L]
R42  100  [Res 0805 SMD]
R43  100K  [Res 0805 SMD]
R44  2K7-0805  [RESC2012L]
R45  100R-0805  [RESC2012L]
R46  100  [Res 0805 SMD]
R47  2K7-0805  [RESC2012L]
R48  100K  [Res 0805 SMD]
R49  100R-0805  [RESC2012L]
R50  2K7-0805  [RESC2012L]
R51  100  [Res 0805 SMD]
R52  100K  [Res 0805 SMD]
R53  100R-0805  [RESC2012L]
R54  100  [Res 0805 SMD]
R55  100K  [Res 0805 SMD]
U1  IRF3205  [TO-220]
U2  IRF3205  [TO-220]
U3  IRF3205  [TO-220]
U4  IRF3205  [TO-220]
U5  IRF3205  [TO-220]
U6  IRF3205  [TO-220]
U7  IRF3205  [TO-220]

### Ports
CLK (in), DATA (in), LAT (in)

### Nets
+12: D2.2(K) D3.2(K) D6.2(K) D8.2(K) D10.2(K) D12.2(K) D13.2(K) P3.2 P4.4 P5.2 P6.4 P7.2 P8.4 P9.2 P10.4 P11.2 P12.4 P13.2 P14.4 P15.2 P16.4 R27.2 R30.2 R35.2 R39.2 R44.2 R47.2 R50.2
GND: C16.2 C17.2 IC2.8(GND) IC2.13(~{OE}) IC3.8(GND) IC3.13(~{OE}) P4.2 P6.2 P8.2 P10.2 P12.2 P14.2 P16.2
P_GND: D4.1(A) D5.1(A) D7.1(A) D9.1(A) D11.1(A) D14.1(A) D15.1(A) R31.1 R34.1 R38.1 R43.1 R48.1 R52.1 R55.1 U1.3(S) U2.3(S) U3.3(S) U4.3(S) U5.3(S) U6.3(S) U7.3(S)
VCC: C16.1 C17.1 IC2.10(~{MR}) IC2.16(VCC) IC3.10(~{MR}) IC3.16(VCC)  [project net 3V3]
7S_1: IC3.15(QA) JP4.1
7S_2: IC3.1(QB) JP4.2
7S_3: IC3.2(QC) JP4.3
7S_4: IC3.3(QD) JP4.4
7S_5: IC3.4(QE) JP4.5
7S_6: IC3.5(QF) JP4.6
7S_7: IC3.6(QG) JP4.7
7S_8: IC3.7(QH) JP4.8
CLK: IC2.11(SCK) IC3.11(SCK) ; port CLK
DATA: IC2.14(SDA) ; port DATA
LAT: IC2.12(LAT) IC3.12(LAT) ; port LAT
LOAD_1: IC2.1(QB) R49.2
LOAD_2: IC2.2(QC) R53.2
LOAD_3: IC2.3(QD) R41.2
LOAD_4: IC2.4(QE) R45.2
LOAD_5: IC2.5(QF) R36.2
LOAD_6: IC2.6(QG) R32.2
LOAD_7: IC2.7(QH) R28.2
NetD2_1: D2.1(A) L6.2(K) P3.1 U1.2(D)
NetD3_1: D3.1(A) L7.2(K) P5.1 U2.2(D)
NetD4_2: D4.2(K) P4.3 R29.2
NetD5_2: D5.2(K) P6.3 R33.2
NetD6_1: D6.1(A) L8.2(K) P7.1 U3.2(D)
NetD7_2: D7.2(K) P8.3 R37.2
NetD8_1: D8.1(A) L9.2(K) P9.1 U4.2(D)
NetD9_2: D9.2(K) P10.3 R42.2
NetD10_1: D10.1(A) L10.2(K) P11.1 U5.2(D)
NetD11_2: D11.2(K) P12.3 R46.2
NetD12_1: D12.1(A) L11.2(K) P13.1 U6.2(D)
NetD13_1: D13.1(A) L12.2(K) P15.1 U7.2(D)
NetD14_2: D14.2(K) P14.3 R51.2
NetD15_2: D15.2(K) P16.3 R54.2
NetIC2_9: IC2.9(SQH) R40.1
NetIC3_14: IC3.14(SDA) R40.2
NetL6_1: L6.1(A) R27.1
NetL7_1: L7.1(A) R30.1
NetL8_1: L8.1(A) R35.1
NetL9_1: L9.1(A) R39.1
NetL10_1: L10.1(A) R44.1
NetL11_1: L11.1(A) R47.1
NetL12_1: L12.1(A) R50.1
NetP4_1: P4.1 R28.1
NetP6_1: P6.1 R32.1
NetP8_1: P8.1 R36.1
NetP10_1: P10.1 R41.1
NetP12_1: P12.1 R45.1
NetP14_1: P14.1 R49.1
NetP16_1: P16.1 R53.1
NetR29_1: R29.1 R31.2 U1.1(G)
NetR33_1: R33.1 R34.2 U2.1(G)
NetR37_1: R37.1 R38.2 U3.1(G)
NetR42_1: R42.1 R43.2 U4.1(G)
NetR46_1: R46.1 R48.2 U5.1(G)
NetR51_1: R51.1 R52.2 U6.1(G)
NetR54_1: R54.1 R55.2 U7.1(G)

Not connected (* = marked no-connect by the designer): IC2 15(QA)*; IC3 9(SQH)*

### Buses and harness runs
bus 7S_[1..8]

### Notes on the sheet
- RESET
- Van Hieu
- Date:
- File:
- Size:
- A3
- Number:
- Time:
- Sheet
- Revision:
- of
- BK-DN
- maivanhieu24042003@gmail.com

### Library data of the parts
C16 C17 = CC0805JRNPO9BN200: as C18 on sheet ESP8266; Supplier 1: Mouser; Manufacturer Part Number: CC0805JRNPO9BN200; RoHS: RoHS Compliant By Exemption; Category: Multilayer Ceramic Capacitors MLCC - SMD/SMT; Stock 1: 0; Pricing 1: 1=0.100, 10=0.040, 100=0.018, 1000=0.014, 4000=0.013 (USD); Capacitance: 20 pF; Length: 2 mm; Package / Case: 0805 (2012 metric); Packaging: Cut Tape; Product: General Type MLCCs; Series: CC; Termination Style: SMD/SMT; Tolerance: 5 %; Width: 1.25 mm; Brand: Yageo; Case Code - in: 0805; Case Code - mm: 2012; Maximum Operating Temperature: + 125 C; Minimum Operating Temperature: - 55 C; Product Type: Ceramic Capacitors; Standard Pack Qty: 4000; Subcategory: Capacitors; Termination: Standard; RoHS - Mouser: E; Minimum Order Quantity: 1; Reeling: True; ComponentLink1URL: http://www.mouser.com/datasheet/2/447/UPY-GP_NP0_16V-to-50V_16-1109089.pdf; ComponentLink1Description: http://www.mouser.com/datasheet/2/447/UPY-GP_NP0_16V-to-50V_16-1109089.pdf; Supplier Part Number 1: 603-CC805JRNPO9BN200
D2-D15 = 1N4148WS: DIO GEN 75V 0.15A SOD323 SMD; MFR: ONSEMI; UNIT: PCS; MFR PN: 1N4148WS; LINK: NA; PRICE: NA
IC2 IC3 = 74595: 8 Bit Serial input - Parallel Output; Value: 74HC595
JP4 = Con8: Connector 8; Value: Connector 8
L6-L12 = LED GREEN 0805: as L19 on sheet Block_Diagram; Ghi_Chu: *; Kieu_Chan: *
P4 P6 P8 P10 P12 P14 P16 = PC817: NPN PHOTO General Purpose Amplifier; Published: 8-Jun-2000; LatestRevisionDate: 15-Jan-2003; LatestRevisionNote: PCB Footprint 'BCY-W3/D4.7' replaced; DatasheetDocument: 1997; PackageReference: TO-92A; Publisher: Altium Limited; Code_JEDEC: TO-92A
R27-R39 R41-R55 = 34.8K/R0805/1%_3: as R70 on sheet Block_Diagram; Case/Package: 0603; Case Code (Imperial): 0603; Case Code (Metric): 1608; Min Operating Temperature: -55°C; Max Operating Temperature: 155°C; Termination: SMD/SMT; Military Standard: Not; Voltage Rating (DC): 50V; Length: 1.6mm; Height: 0.45mm; Width: 0.8mm; Depth: 0.8mm; Lead Free: Lead Free; Digikey: 541-1.00KCCT-ND
R40 = RC0805JR-0710KL: RES SMD 10K OHM 5% 1/8W 0805; Manufacturer: Yageo; Power (Watts): 0.125W, 1/8W; Temperature Coefficient: ±100ppm/°C; Supplier 1: Digi-Key; Manufacturer Part Number: RC0805JR-0710KL; RoHS: RoHS Compliant; Category: Resistors; Stock 1: 0; Pricing 1: 1=0.1, 10=0.036, 100=0.0145, 1000=0.00652, 2500=0.00566 (USD); Packaging: Cut Tape (CT); Part Status: Active; Tolerance: ±5%; Composition: Thick Film; Features: Moisture Resistant; Operating Temperature: -55°C ~ 155°C; Package / Case: 0805 (2012 Metric); Supplier Device Package: 0805; Size / Dimension: 0.079" L x 0.049" W (2.00mm x 1.25mm); Height - Seated (Max): 0.024" (0.60mm); Failure Rate: -; ComponentLink1URL: http://www.yageo.com/documents/recent/PYu-RC_Group_51_RoHS_L_9.pdf; ComponentLink1Description: http://www.yageo.com/documents/recent/PYu-RC_Group_51_RoHS_L_9.pdf; Supplier Part Number 1: 311-10KARCT-ND
U1-U7 = IRF3205: MOSFET N-CH 55V 110A TO-220AB

## Sheet STM32F103C8T6.SchDoc
size A3; Author: Van Hieu; Organization: BACH-KHOA-DK; Gmail: maivanhieu24042003@gmail.com
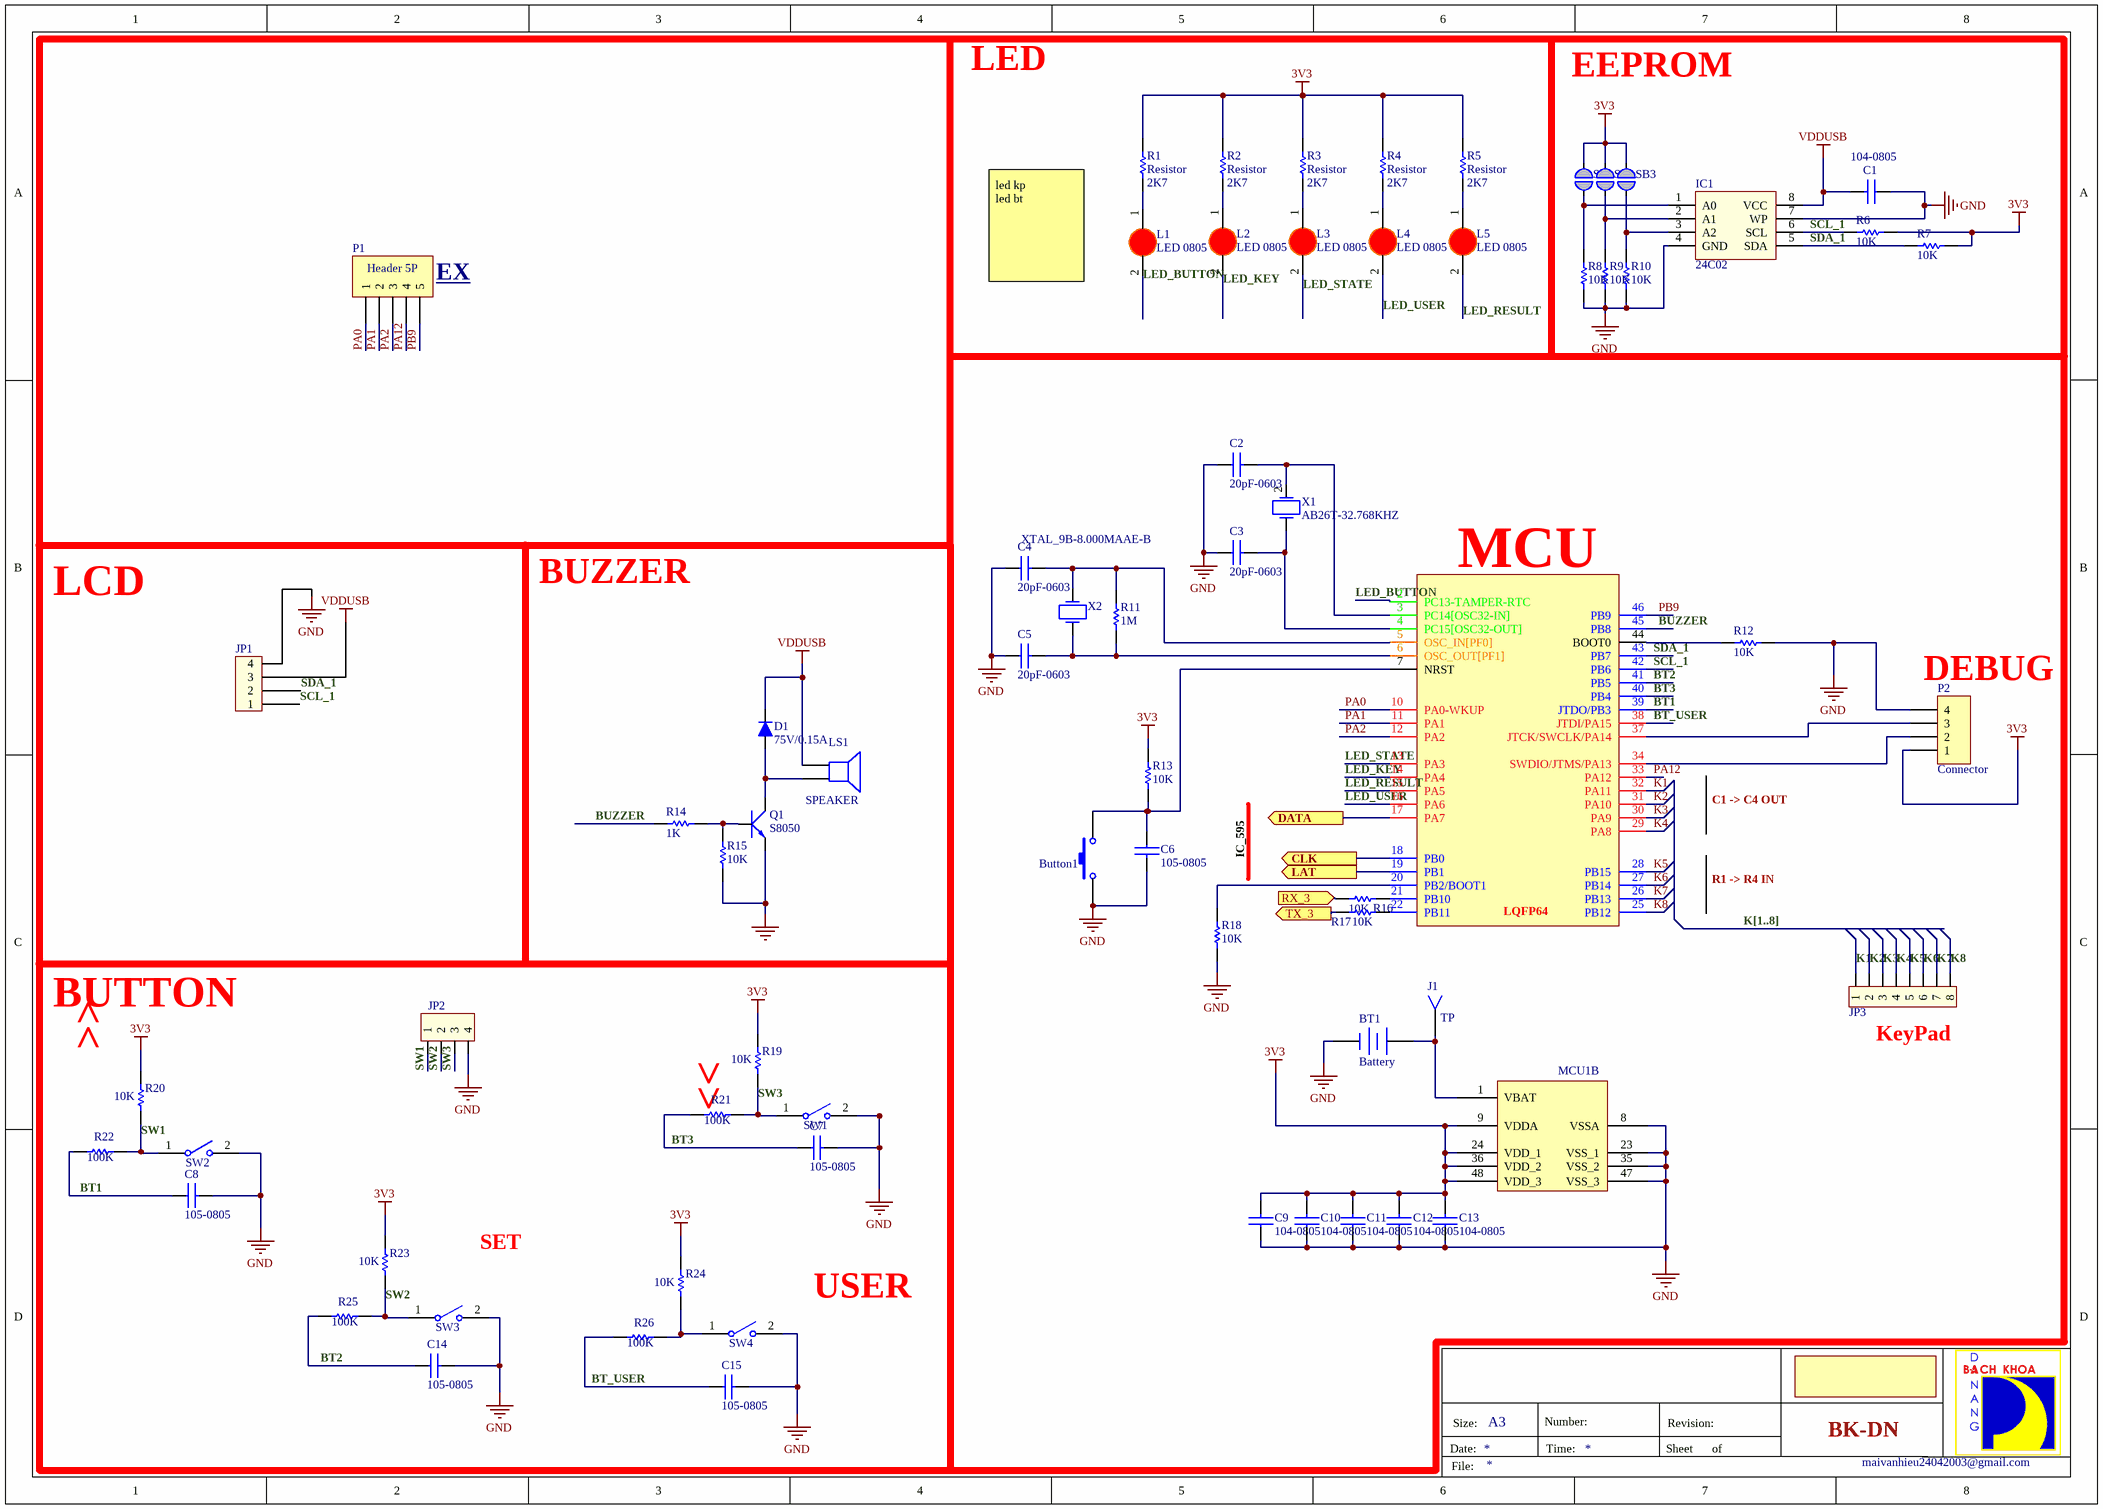
[diagram p4: STM32F103C8T6.SchDoc]

### Parts
BT1  Battery  [CR1220_3V BATTERY HOLDER]
Button1  RS-282G05A3-SM RT  [SW_RS-282G05A3-SM RT]  (value not drawn)
C1  104-0805  [CAP0805]
C2  20pF-0603  [CAP0603]
C3  20pF-0603  [CAP0603]
C4  20pF-0603  [CAP0603]
C5  20pF-0603  [CAP0603]
C6  105-0805  [CAP0805]
C7  105-0805  [CAP0805]
C8  105-0805  [CAP0805]
C9  104-0805  [CAP0805]
C10  104-0805  [CAP0805]
C11  104-0805  [CAP0805]
C12  104-0805  [CAP0805]
C13  104-0805  [CAP0805]
C14  105-0805  [CAP0805]
C15  105-0805  [CAP0805]
D1  75V/0.15A  [DIO-SOD123-1.35H]
IC1  24C02  [DIP8/W0.3]
J1  TP  [TEST_POINT_1.0X1.0MM]
JP1  v  [CON4]  (value not drawn)
JP2  JP4  [CON4]  (value not drawn)
JP3  KeyPad  [JP8]
L1  LED 0805  [LED-RED-0805]
L2  LED 0805  [LED-RED-0805]
L3  LED 0805  [LED-RED-0805]
L4  LED 0805  [LED-RED-0805]
L5  LED 0805  [LED-RED-0805]
LS1  SPEAKER  [SPEAKER]
MCU1  https://www.st.com/resource/en/datasheet/stm32f103c8.pdf  [LQFP48_L]  (value not drawn)  (parts A,B of 2)
P1  Header 5P  [HDR1X5]
P2  Connector  [HDR1X4]
Q1  S8050  [SOT23B]
R1  Resistor  value 2K7  [RESC2012L]
R2  Resistor  value 2K7  [RESC2012L]
R3  Resistor  value 2K7  [RESC2012L]
R4  Resistor  value 2K7  [RESC2012L]
R5  Resistor  value 2K7  [RESC2012L]
R6  value 10K  [RESC2012L]  (hidden comment: Resistor)
R7  value 10K  [RESC2012L]  (hidden comment: Resistor)
R8  value 10K  [RESC2012L]  (hidden comment: Resistor)
R9  value 10K  [RESC2012L]  (hidden comment: Resistor)
R10  value 10K  [RESC2012L]  (hidden comment: Resistor)
R11  value 1M  [RESC2012L]  (hidden comment: Resistor)
R12  value 10K  [RESC2012L]  (hidden comment: Resistor)
R13  value 10K  [RESC2012L]  (hidden comment: Resistor)
R14  value 1K  [RESC2012L]  (hidden comment: Resistor)
R15  value 10K  [RESC2012L]  (hidden comment: Resistor)
R16  value 10K  [RESC2012L]  (hidden comment: Resistor)
R17  value 10K  [RESC2012L]  (hidden comment: Resistor)
R18  value 10K  [RESC2012L]  (hidden comment: Resistor)
R19  value 10K  [RESC2012L]  (hidden comment: Resistor)
R20  value 10K  [RESC2012L]  (hidden comment: Resistor)
R21  value 100K  [RESC2012L]  (hidden comment: Resistor)
R22  value 100K  [RESC2012L]  (hidden comment: Resistor)
R23  value 10K  [RESC2012L]  (hidden comment: Resistor)
R24  value 10K  [RESC2012L]  (hidden comment: Resistor)
R25  value 100K  [RESC2012L]  (hidden comment: Resistor)
R26  value 100K  [RESC2012L]  (hidden comment: Resistor)
SB1  Solderbridge  [Solderbridge]  (value not drawn)  (no BOM)
SB2  Solderbridge  [Solderbridge]  (value not drawn)  (no BOM)
SB3  Solderbridge  [Solderbridge]  (value not drawn)  (no BOM)
SW1  3x4x2.5 2Pin SMD  [Button 3x4mm]  (value not drawn)
SW2  3x4x2.5 2Pin SMD  [Button 3x4mm]  (value not drawn)
SW3  3x4x2.5 2Pin SMD  [Button 3x4mm]  (value not drawn)
SW4  3x4x2.5 2Pin SMD  [Button 3x4mm]  (value not drawn)
X1  AB26T-32.768KHZ  [XTAL_THG_32768Hz]
X2  XTAL_9B-8.000MAAE-B  [XTAL_THG_HC49/US]

### Ports
CLK (out), DATA (out), LAT (out), RX_3 (in), TX_3 (out)

### Nets
3V3: C9.2 C10.2 C11.2 C12.2 C13.2 MCU1.9(VDDA) MCU1.24(VDD_1) MCU1.36(VDD_2) MCU1.48(VDD_3) P2.1 R1.2 R2.2 R3.2 R4.2 R5.2 R6.2 R7.2 R13.2 R19.1 R20.1 R23.1 R24.1 SB1.1 SB2.1 SB3.2
GND: BT1.2(-) Button1.2 C1.1 C2.1 C3.1 C4.1 C5.1 C6.2 C7.2 C8.2 C9.1 C10.1 C11.1 C12.1 C13.1 C14.2 C15.2 IC1.4(GND) IC1.7(WP) JP1.4 JP2.4 MCU1.8(VSSA) MCU1.23(VSS_1) MCU1.35(VSS_2) MCU1.47(VSS_3) P2.4 Q1.3(E) R8.1 R9.1 R10.1 R12.2 R15.2 R18.1 SW1.2(NO1) SW2.2(NO1) SW3.2(NO1) SW4.2(NO1)
VDDUSB: C1.2 D1.2(K) IC1.8(VCC) JP1.3 LS1.1
BT1: C8.1 MCU1.39(JTDO/PB3) R22.2
BT2: C14.1 MCU1.41(PB5) R25.2
BT3: C7.1 MCU1.40(PB4) R21.2
BT_USER: C15.1 MCU1.38(JTDI/PA15) R26.2
BUZZER: MCU1.45(PB8) R14.2
CLK: MCU1.18(PB0) ; port CLK
DATA: MCU1.17(PA7) ; port DATA
K1: JP3.1 MCU1.32(PA11)
K2: JP3.2 MCU1.31(PA10)
K3: JP3.3 MCU1.30(PA9)
K4: JP3.4 MCU1.29(PA8)
K5: JP3.5 MCU1.28(PB15)
K6: JP3.6 MCU1.27(PB14)
K7: JP3.7 MCU1.26(PB13)
K8: JP3.8 MCU1.25(PB12)
LAT: MCU1.19(PB1) ; port LAT
LED_BUTTON: L1.2(K) MCU1.2(PC13-TAMPER-RTC)
LED_KEY: L2.2(K) MCU1.14(PA4)
LED_RESULT: L5.2(K) MCU1.15(PA5)
LED_STATE: L3.2(K) MCU1.13(PA3)
LED_USER: L4.2(K) MCU1.16(PA6)
PA0: MCU1.10(PA0-WKUP) P1.1
PA1: MCU1.11(PA1) P1.2
PA2: MCU1.12(PA2) P1.3
PA12: MCU1.33(PA12) P1.4
PB9: MCU1.46(PB9) P1.5
RX_3: R16.1 ; port RX_3
SCL_1: IC1.6(SCL) JP1.1 MCU1.42(PB6) R6.1
SDA_1: IC1.5(SDA) JP1.2 MCU1.43(PB7) R7.1
SW1: JP2.1 R20.2 R22.1 SW2.1(COMMON1)
SW2: JP2.2 R23.2 R25.1 SW3.1(COMMON1)
SW3: JP2.3 R19.2 R21.1 SW1.1(COMMON1)
TX_3: R17.1 ; port TX_3
NetBT1_1: BT1.1(+) J1.1 MCU1.1(VBAT)
NetButton1_1: Button1.1 C6.1 MCU1.7(NRST) R13.1
NetC2_2: C2.2 MCU1.3(PC14[OSC32-IN]) X1.2(OSC2)
NetC3_2: C3.2 MCU1.4(PC15[OSC32-OUT]) X1.1(OSC1)
NetC4_2: C4.2 MCU1.5(OSC_IN[PF0]) R11.2 X2.2(OSC2)
NetC5_2: C5.2 MCU1.6(OSC_OUT[PF1]) R11.1 X2.1(OSC1)
NetD1_1: D1.1(A) LS1.2 Q1.2(C)
NetIC1_1: IC1.1(A0) R8.2 SB1.2
NetIC1_2: IC1.2(A1) R9.2 SB2.2
NetIC1_3: IC1.3(A2) R10.2 SB3.1
NetL1_1: L1.1(A) R1.1
NetL2_1: L2.1(A) R2.1
NetL3_1: L3.1(A) R3.1
NetL4_1: L4.1(A) R4.1
NetL5_1: L5.1(A) R5.1
NetMCU1_20: MCU1.20(PB2/BOOT1) R18.2
NetMCU1_21: MCU1.21(PB10) R16.2
NetMCU1_22: MCU1.22(PB11) R17.2
NetMCU1_34: MCU1.34(SWDIO/JTMS/PA13) P2.2
NetMCU1_37: MCU1.37(JTCK/SWCLK/PA14) P2.3
NetMCU1_44: MCU1.44(BOOT0) R12.1
NetQ1_1: Q1.1(B) R14.1 R15.1
NetR24_2: R24.2 R26.1 SW4.1(COMMON1)

### Buses and harness runs
bus K[1..8]

### Notes on the sheet
- LED
- EEPROM
- (near P1) EX <dư>
- led kp
  led bt
- BUZZER
- (near MCU1) MCU
- LCD
- (near P2) DEBUG
- IC_595
- C1 -> C4 OUT
- R1 -> R4 IN
- BUTTON
- (near R20) >>
- (near R19) >>
- SET
- (near SW4) USER
- Van Hieu
- Date:
- Size:
- A3
- Number:
- Time:
- Sheet
- Revision:
- of
- BK-DN
- File:
- maivanhieu24042003@gmail.com
- (in symbol STM32F103C8T6, part A) LQFP64

### Library data of the parts
BT1 = Battery: Multicell Battery; Published: 24-Mar-1999; LatestRevisionDate: 17-Jul-2002; LatestRevisionNote: Re-released for DXP Platform.; PackageReference: BAT-2; Publisher: Altium Limited
Button1 = SW_RS-282G05A3-SM RT: as SW5 on sheet ESP8266; Supplier 1: Digi-Key; Manufacturer Part Number: RS-282G05A3-SM RT; RoHS: RoHS Compliant; Category: Switches; Stock 1: 34459; Pricing 1: 1=0.81, 10=0.78, 25=0.7356, 50=0.6474, 100=0.5885, 250=0.55908, 500=0.54436, 1000=0.42666 (USD); Packaging: Digi-Reel®; Part Status: Active; Circuit: SPST-NO; Mounting Type: Surface Mount; Actuator Length, Right Angle: -; Termination Style: Gull Wing; Illumination Type, Color: -; Illumination Voltage (Nominal): -; Ingress Protection: -; Features: -; Operating Temperature: -; ComponentLink1URL: http://media.digikey.com/pdf/Data%20Sheets/C&K/RS-282G05A-SM_RT.pdf; ComponentLink1Description: http://media.digikey.com/pdf/Data%20Sheets/C&K/RS-282G05A-SM_RT.pdf; Supplier Part Number 1: CKN10384DKR-ND
C1 C6-C15 = CC0805JRNPO9BN200: as C18 on sheet ESP8266; Supplier 1: Mouser; Manufacturer Part Number: CC0805JRNPO9BN200; RoHS: RoHS Compliant By Exemption; Category: Multilayer Ceramic Capacitors MLCC - SMD/SMT; Stock 1: 0; Pricing 1: 1=0.100, 10=0.040, 100=0.018, 1000=0.014, 4000=0.013 (USD); Capacitance: 20 pF; Length: 2 mm; Package / Case: 0805 (2012 metric); Packaging: Cut Tape; Product: General Type MLCCs; Series: CC; Termination Style: SMD/SMT; Tolerance: 5 %; Width: 1.25 mm; Brand: Yageo; Case Code - in: 0805; Case Code - mm: 2012; Maximum Operating Temperature: + 125 C; Minimum Operating Temperature: - 55 C; Product Type: Ceramic Capacitors; Standard Pack Qty: 4000; Subcategory: Capacitors; Termination: Standard; RoHS - Mouser: E; Minimum Order Quantity: 1; Reeling: True; ComponentLink1URL: http://www.mouser.com/datasheet/2/447/UPY-GP_NP0_16V-to-50V_16-1109089.pdf; ComponentLink1Description: http://www.mouser.com/datasheet/2/447/UPY-GP_NP0_16V-to-50V_16-1109089.pdf; Supplier Part Number 1: 603-CC805JRNPO9BN200
C2-C5 = CC0603JRNPO9BN200: CAP CER 20PF 50V C0G/NPO 0603; Manufacturer 1: Yageo; Category 1: Capacitors; Tolerance: ±5%; Temperature Coefficient: C0G, NP0; Supplier 1: Digi-Key; Supplier Part Number 1: 311-1424-1-ND; Manufacturer Part Number 1: CC0603JRNPO9BN200; RoHS 1: RoHS Compliant; Description 1: CAP CER 20PF 50V C0G/NPO 0603; Stock 1: 67895; Pricing 1: 1=0.1, 10=0.037, 100=0.0164, 500=0.01172, 1000=0.0092 (USD); Packaging: Cut Tape (CT); Part Status: Active; Capacitance: 20pF; Voltage - Rated: 50V; Operating Temperature: -55°C ~ 125°C; Features: -; Ratings: -; Applications: General Purpose; Failure Rate: -; Mounting Type: Surface Mount, MLCC; Package / Case: 0603 (1608 Metric); Size / Dimension: 0.063" L x 0.031" W (1.60mm x 0.80mm); Height - Seated (Max): -; Thickness (Max): 0.035" (0.90mm); Lead Spacing: -; Lead Style: -; ComponentLink1URL: http://www.yageo.com/documents/recent/UPY-GP_NP0_16V-to-50V_16.pdf; ComponentLink1Description: http://www.yageo.com/documents/recent/UPY-GP_NP0_16V-to-50V_16.pdf; Value: 20pF
D1 = 1N4148/W/WS: DIO GEN 75V 0.15A SOD323 SMD; MFR PN: 1N4148WS; MFR: ONSEMI; UNIT: PCS; LINK: NA; PRICE: NA
IC1 = 24Cxx: Standard 2-Wire Bus Interface Serial EEPROM; Value: 24Cxx; Value: DIP 8; Copyright by: VanDungEvn
J1 = TEST POINT 1.0X1.0: as J3 on sheet Block_Diagram; Supplier 1: Digi-Key; Supplier Part Number 1: PTV09A-4020U-B103-ND; RoHS 1: RoHS Compliant; Stock 1: 414; Pricing 1: 1=0.83, 10=0.744, 25=0.672, 50=0.648, 100=0.612, 250=0.588, 500=0.552, 1000=0.456, 5000=0.372 (USD); Packaging: Tray; Part Status: Active; Taper: Linear; Temperature Coefficient: -; Termination Style: PC Pins, Board Locks; Bushing Thread: -; Mounting Type: Through Hole, Snap In; ComponentLink1URL: http://www.bourns.com/docs/Product-Datasheets/PTV09.pdf; ComponentLink1Description: http://www.bourns.com/docs/Product-Datasheets/PTV09.pdf
JP1 JP2 = Con4: Connector 4; Value: Connector 4
JP3 = JP8: JP8 PIN; Value: JP7
L1-L5 = LED RED 0805: as L16 on sheet Block_Diagram; Ghi_Chu: *; Kieu_Chan: *
MCU1 = STM32F103C8T6: Arm® 32-bit Cortex®-M3 CPU core / – 72 MHz maximum frequency, 1.25 / DMIPS/MHz (Dhrystone 2.1) performance / at 0 wait state memory access / – Single-cycle multiplication and hardware / division
P1 = Header 5x1: Header, 5 Pin Pitch 2.54mm; MPN: S1012EC-40-ND; CompanyID: VT-00125; Solder: WAVE; Value: Header 5P
P2 = Connector_4pin
Q1 = C1815: NPN 600mW, ECB; Value: C1815
R1-R26 = Resistor: Semiconductor Resistor; Published: 8-Jun-2000; LatestRevisionDate: 17-Jul-2002; LatestRevisionNote: Re-released for DXP Platform.; PackageReference: AXIAL-0.5; Publisher: Altium Limited
SB1-SB3 = SOLDERBRIDGE: Artikkelnr Noca: N.A.; Part Number: Solderbridge; Manufacturer: *; Manufacturer Part Number: *; Footprint Doc: Solderbridge; LatestRevisionDate: 2009-12-14; Pin Count: 2; Publisher: Nordic Semiconductor; Published: 2009-12-14; Value: Solderbridge; Note: *; Supplier: *; Supplier part number: *; 2nd source Supplier: *; 2nd source part number: *; Artikkelnr Simpro: N.A.; ComponentLink1Description: Datasheet; ComponentLink1URL: *; ComponentLink2Description: Supplier link; ComponentLink2URL: *; HelpURL: *
SW1-SW4 = BUTTON 2-SMD RS-282G05A3: Manufacturer: C&K Components; Manufacturer Part Number: RS-282G05A3-SM RT; Circuit: SPST-NO; Switch Function: Off-Mom; Contact Rating @ Voltage: 0.05A @ 12VDC; Actuator Type: Rectangular Button; Actuator Height off PCB, from Pins: 2.50mm; Actuator Orientation: Top Actuated; Outline: 6.00mm x 3.60mm; Illumination: Non-Illuminated; Operating Force: 250gf; Actuator Material: Polyamide (PA), Nylon; Switch Travel: 0.25mm; Mechanical Life: 50,000 Cycles; RoHS: RoHS Compliant; Category: Switches; Packaging: Cut Tape (CT); Part Status: Active; Mounting Type: Surface Mount; Termination Style: Gull Wing; Illumination Voltage (Nominal): -; Illumination Type, Color: -; Ingress Protection: -; Features: -; Operating Temperature: -; ComponentLink1URL: http://media.digikey.com/pdf/Data%20Sheets/C&K/RS-282G05A-SM_RT.pdf; ComponentLink1Description: http://media.digikey.com/pdf/Data%20Sheets/C&K/RS-282G05A-SM_RT.pdf; Supplier 1: Digi-Key; Supplier Part Number 1: CKN10384CT-ND; Buy Link: https://thegioiic.com/products/nut-nhan-3x4x2-5-2pin-smd
X1 = XTAL_AB26T-32.768KHZ: CRYSTAL 32.7680KHZ 12.5PF T/H; Manufacturer: Abracon LLC; Frequency Tolerance: ±20ppm; Operating Mode: Fundamental; Supplier 1: Digi-Key; Manufacturer Part Number: AB26T-32.768KHZ; RoHS: RoHS Compliant; Category: Crystals, Oscillators, Resonators; Stock 1: 17810; Pricing 1: 1=0.21, 10=0.175, 50=0.1576, 100=0.14, 500=0.133, 1000=0.112, 2500=0.105, 5000=0.1015, 10000=0.098 (USD); Packaging: Bulk; Part Status: Active; Type: kHz Crystal (Tuning Fork); Frequency Stability: -; Load Capacitance: 12.5pF; Operating Temperature: -10°C ~ 60°C; Ratings: -; Mounting Type: Through Hole; Package / Case: Cylindrical Can, Radial; Size / Dimension: 0.083" Dia x 0.244" L (2.10mm x 6.20mm); Height - Seated (Max): 0.244" (6.20mm); ComponentLink1URL: http://www.abracon.com/Resonators/AB26T.pdf; ComponentLink1Description: http://www.abracon.com/Resonators/AB26T.pdf; Supplier Part Number 1: 535-9032-ND
X2 = XTAL_9B-8.000MAAE-B: CRYSTAL 8.0000MHZ 12PF T/H; Manufacturer: TXC CORPORATION; Frequency Stability: ±30ppm; Operating Mode: Fundamental; Supplier 1: Digi-Key; Manufacturer Part Number: 9B-8.000MAAE-B; RoHS: RoHS Compliant; Category: Crystals, Oscillators, Resonators; Stock 1: 0; Pricing 1: 1000=0.192 (USD); Packaging: Bulk; Part Status: Active; Type: MHz Crystal; Frequency Tolerance: ±30ppm; Load Capacitance: 12pF; Operating Temperature: -20°C ~ 70°C; Ratings: -; Mounting Type: Through Hole; Package / Case: HC49/US; Size / Dimension: 0.453" L x 0.197" W (11.50mm x 5.00mm); Height - Seated (Max): 0.145" (3.68mm); ComponentLink1URL: http://www.txccorp.com/download/products/quartz_crystals/2015TXC_9B_33.pdf; ComponentLink1Description: http://www.txccorp.com/download/products/quartz_crystals/2015TXC_9B_33.pdf; Supplier Part Number 1: 9B-8.000MAAE-B-ND

## Nets that join several sheets
3V3: Block_Diagram (8 pins), ESP8266 (12 pins), LOAD (6 pins), STM32F103C8T6 (25 pins)
+12: Block_Diagram (C25.1 D17.2 J8.1 R73.2), LOAD (28 pins)
GND: Block_Diagram (7 pins), ESP8266 (15 pins), LOAD (13 pins), STM32F103C8T6 (37 pins)
P_GND: Block_Diagram (C25.2 JACK_DC1.2 JACK_DC1.3 L19.2), LOAD (21 pins)
VDDUSB: Block_Diagram (5 pins), ESP8266 (J2.1 U8.8), STM32F103C8T6 (5 pins)
CLK: LOAD (IC2.11 IC3.11), STM32F103C8T6 (MCU1.18)
DATA: LOAD (IC2.14), STM32F103C8T6 (MCU1.17)
LAT: LOAD (IC2.12 IC3.12), STM32F103C8T6 (MCU1.19)
RX_3: Block_Diagram (J4.1 L17.2), ESP8266 (U9.7), STM32F103C8T6 (R16.1)
TX_3: Block_Diagram (J3.1 L16.2), ESP8266 (U9.6), STM32F103C8T6 (R17.1)